# EAGLE schematic A20-OLinuXino-Lime2_Rev_C (EAGLE 6.6.0)
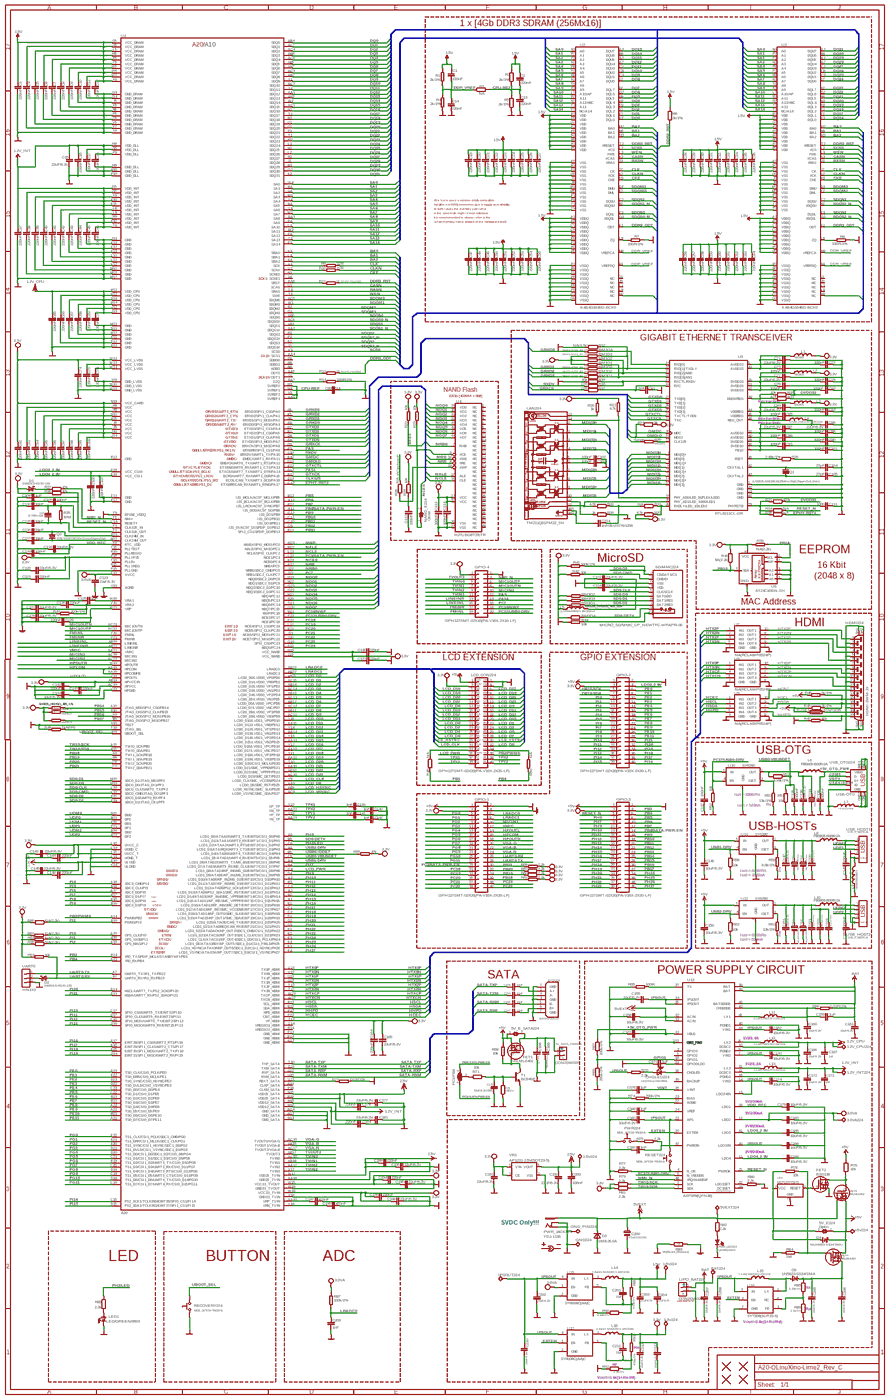
[diagram p0: schematic, sheet 1, overview]
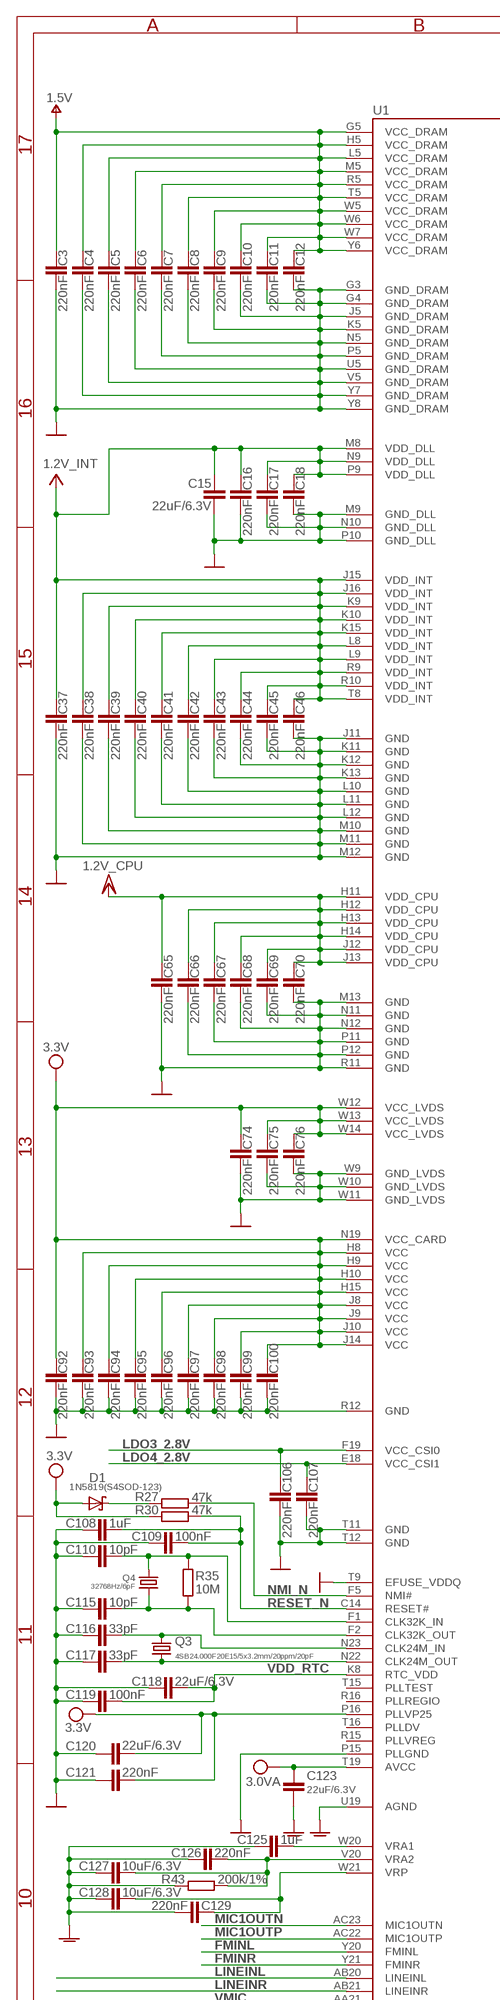
[diagram p1: schematic, sheet 1, part 1 of 4]
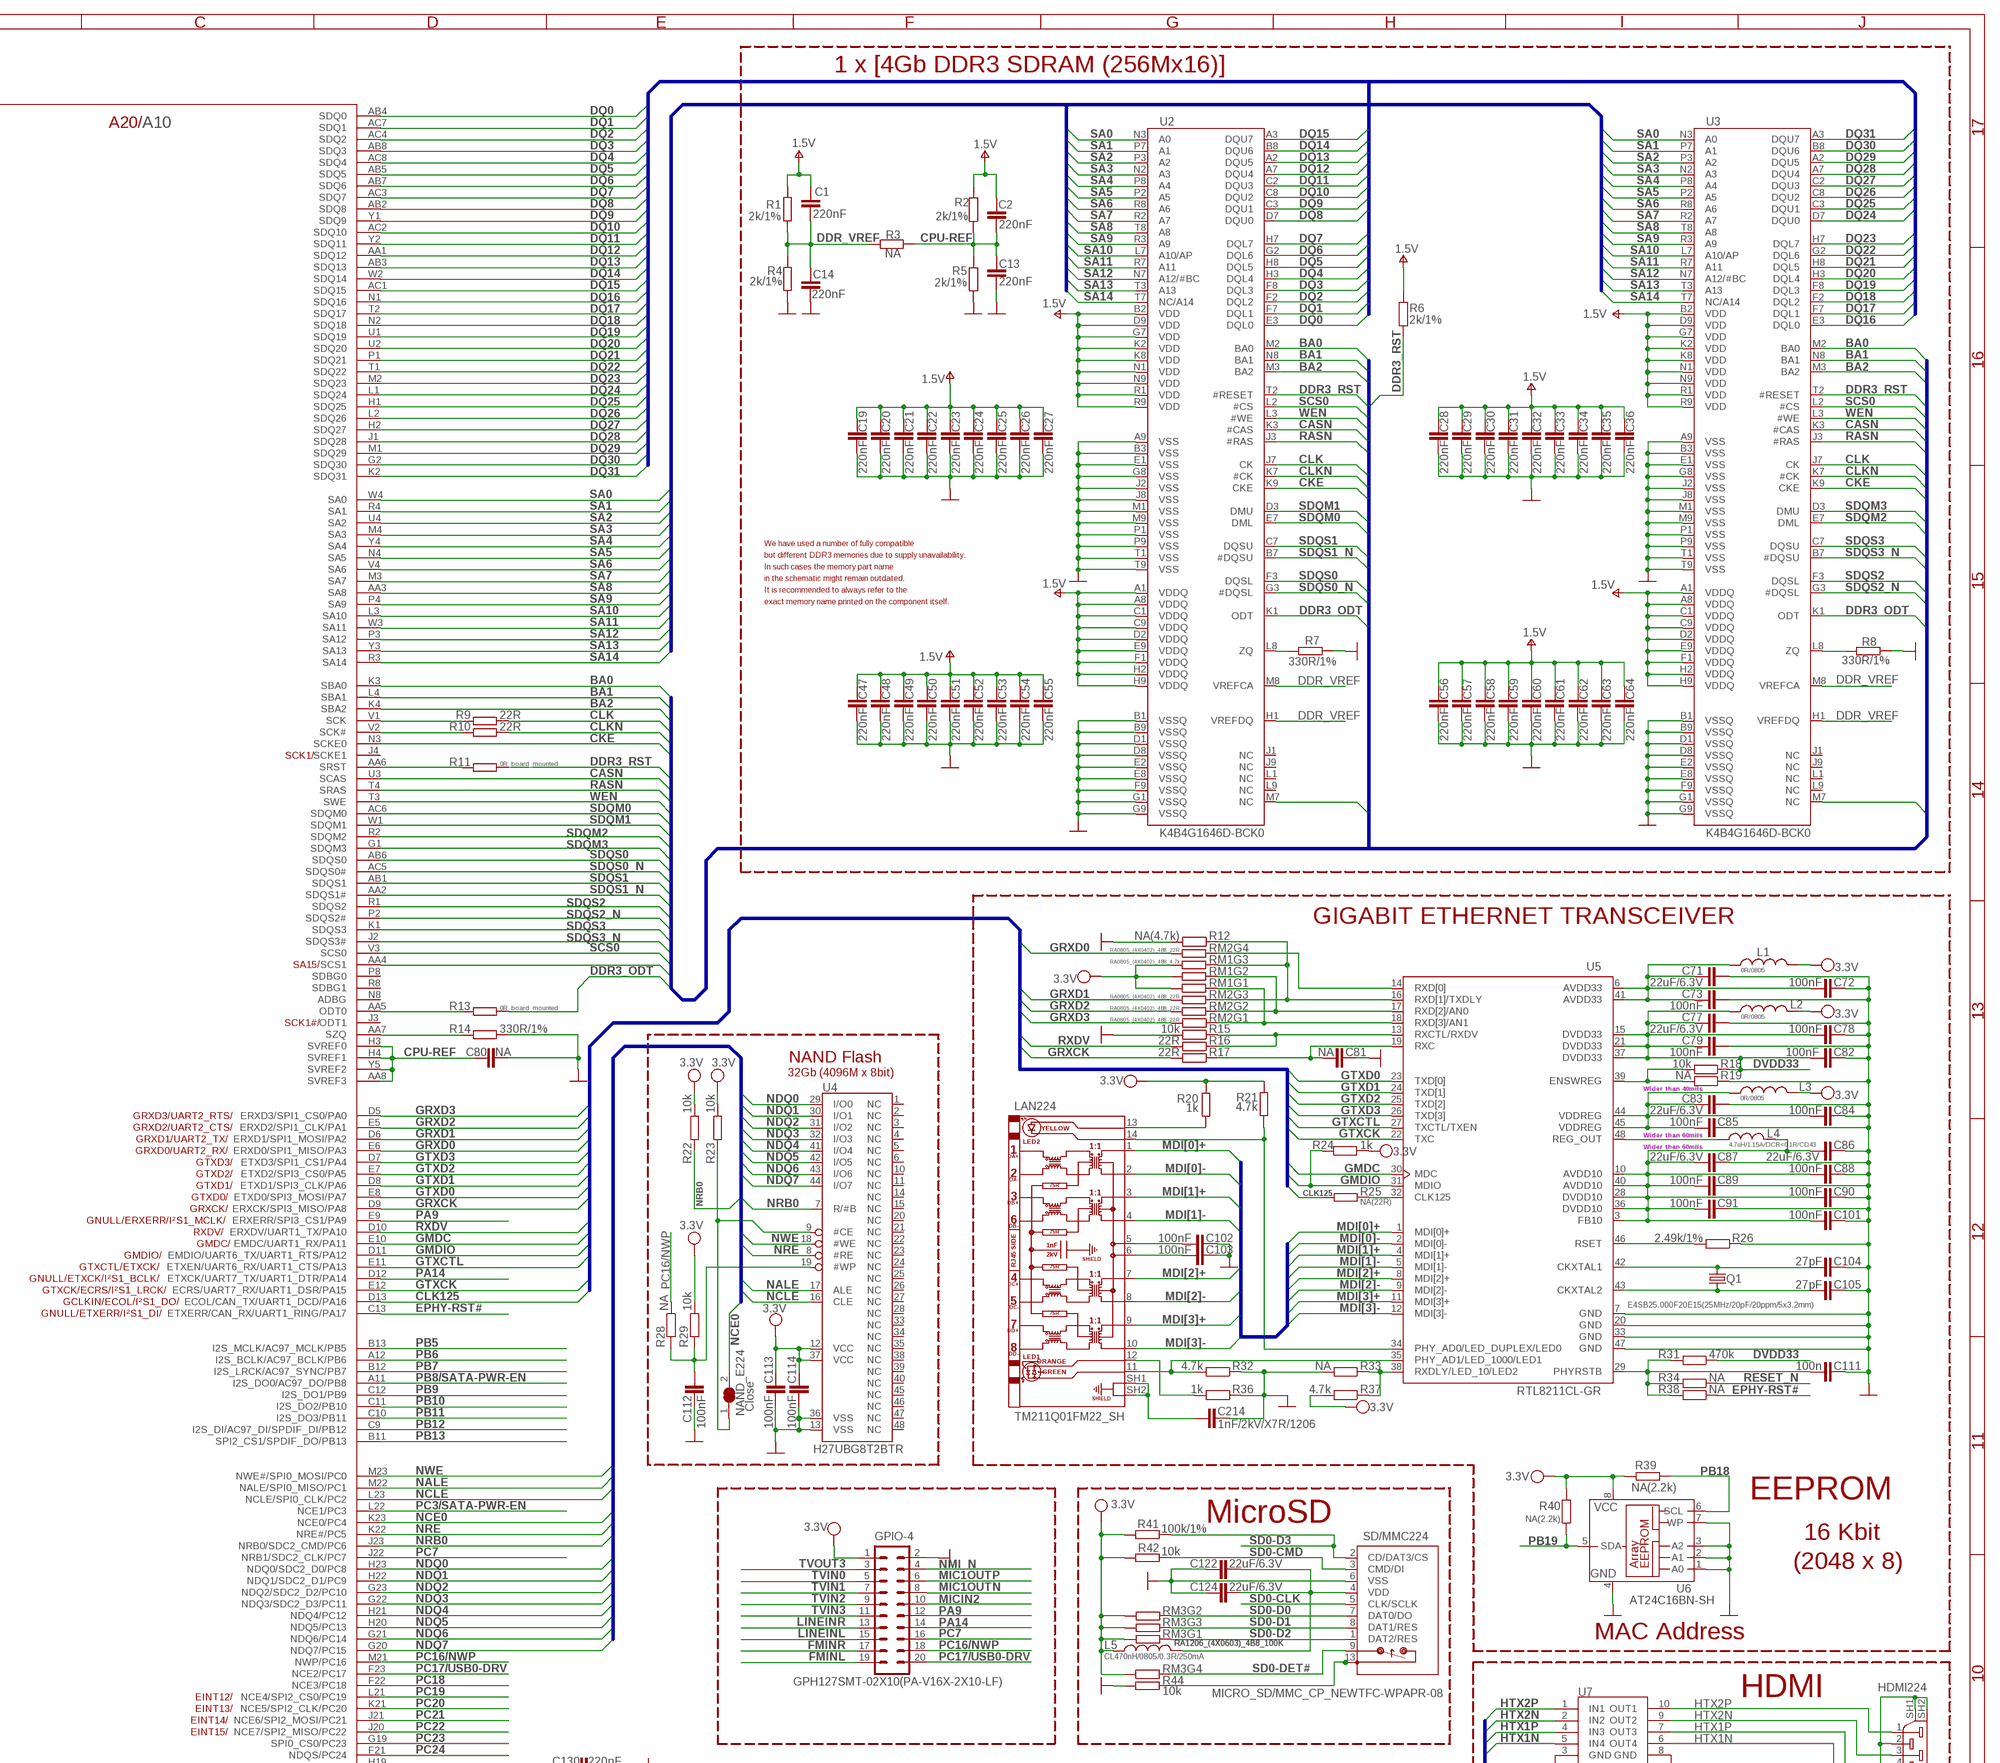
[diagram p2: schematic, sheet 1, part 2 of 4]
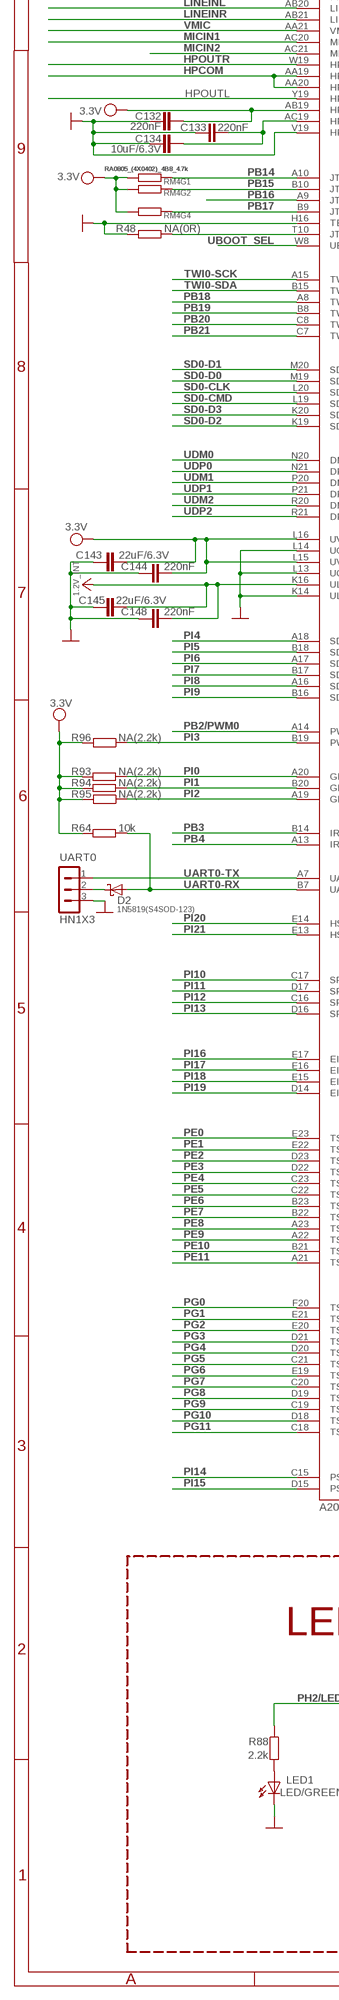
[diagram p3: schematic, sheet 1, part 3 of 4]
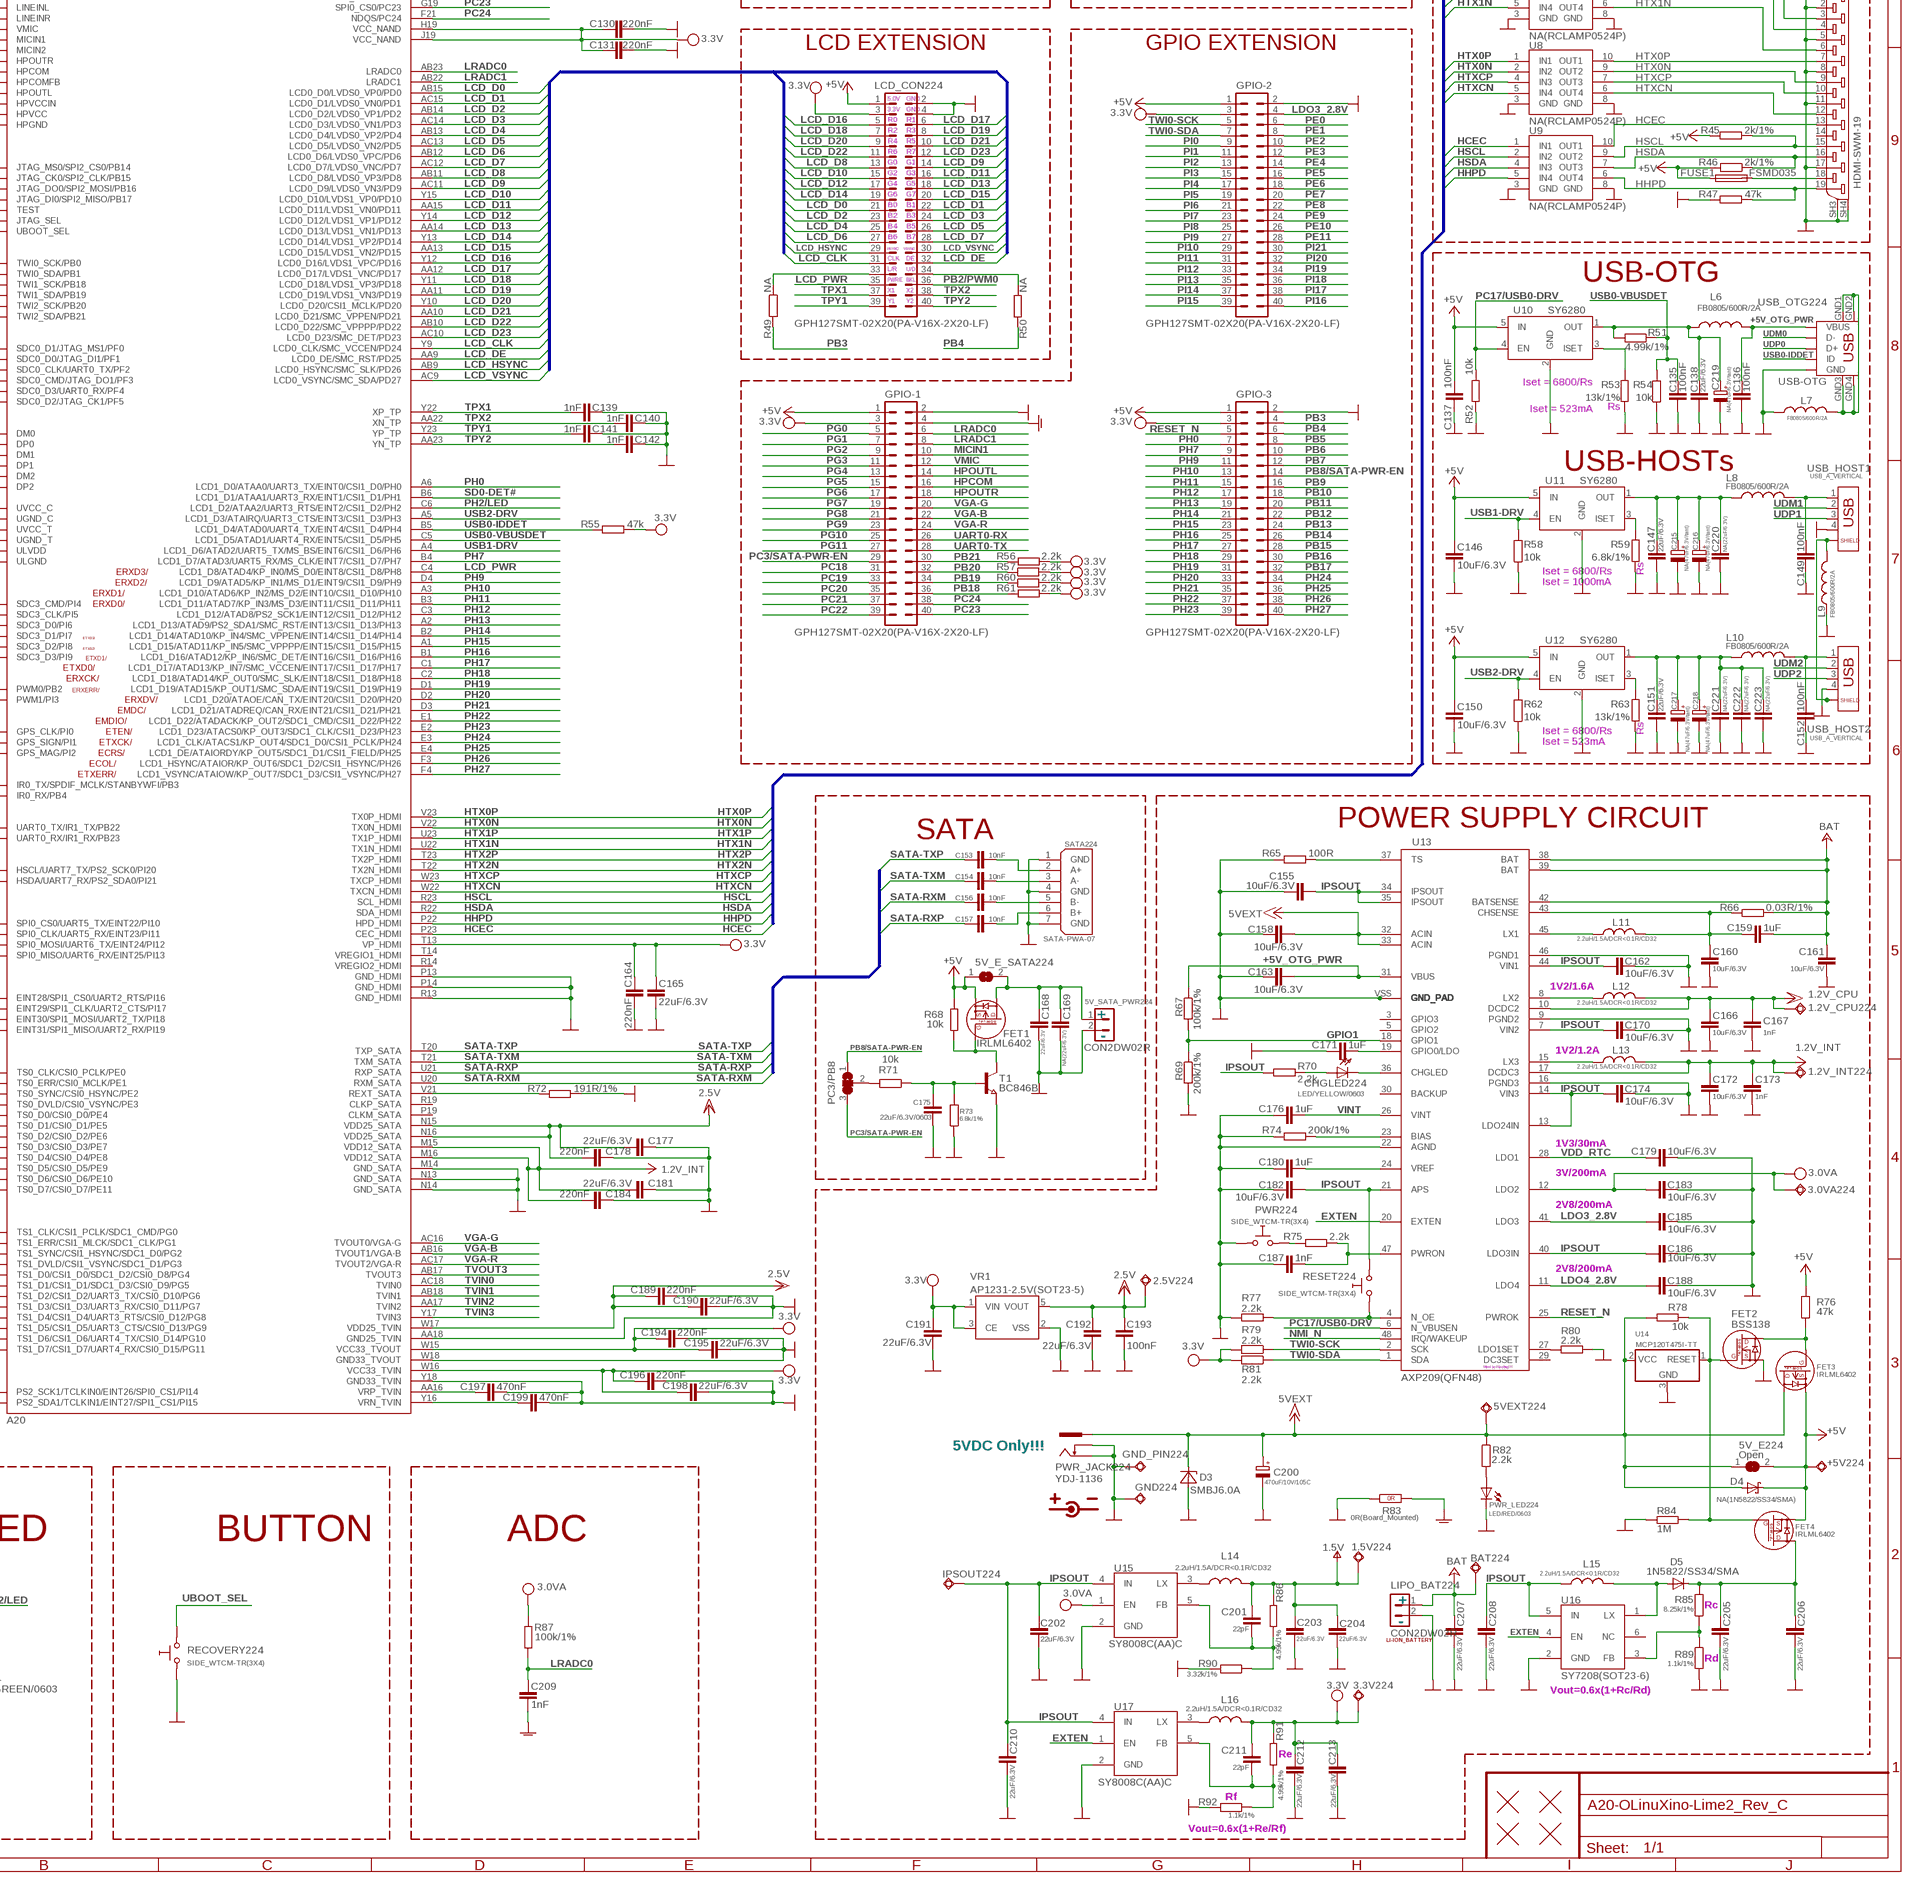
[diagram p4: schematic, sheet 1, part 4 of 4]

## Parts
1.2V_CPU224  TESTPADTESTPAD_40-ROUND  [TESTPAD_40-ROUND]
1.2V_INT224  TESTPADTESTPAD_40-ROUND  [TESTPAD_40-ROUND]
1.5V224  TESTPADTESTPAD_40-ROUND  [TESTPAD_40-ROUND]
2.5V224  TESTPADTESTPAD_40-ROUND  [TESTPAD_40-ROUND]
3.0VA224  TESTPADTESTPAD_40-ROUND  [TESTPAD_40-ROUND]
3.3V224  TESTPADTESTPAD_40-ROUND  [TESTPAD_40-ROUND]
5V_E224  Open  SJSJ_SMALLER  [SJ_1_SMALLER]
5V_E_SATA224  SJSJ_SMALLER  [SJ_1_SMALLER]
5V_SATA_PWR224  CON2DW02R  [DW02R]
5VEXT224  TESTPADTESTPAD_40-ROUND  [TESTPAD_40-ROUND]
+5V224  TESTPADTESTPAD_40-ROUND  [TESTPAD_40-ROUND]
BAT224  TESTPADTESTPAD_40-ROUND  [TESTPAD_40-ROUND]
C1  220nF  C-EUC0402_TI  [C0402_TI]
C2  220nF  C-EUC0402_TI  [C0402_TI]
C3  220nF  C-EUC0402_TI  [C0402_TI]
C4  220nF  C-EUC0402_TI  [C0402_TI]
C5  220nF  C-EUC0402_TI  [C0402_TI]
C6  220nF  C-EUC0402_TI  [C0402_TI]
C7  220nF  C-EUC0402_TI  [C0402_TI]
C8  220nF  C-EUC0402_TI  [C0402_TI]
C9  220nF  C-EUC0402_TI  [C0402_TI]
C10  220nF  C-EUC0402_TI  [C0402_TI]
C11  220nF  C-EUC0402_TI  [C0402_TI]
C12  220nF  C-EUC0402_TI  [C0402_TI]
C13  220nF  C-EUC0402_TI  [C0402_TI]
C14  220nF  C-EUC0402_TI  [C0402_TI]
C15  22uF/6.3V  C-EUC0603_DWS  [C0603_DWS]
C16  220nF  C-EUC0402_TI  [C0402_TI]
C17  220nF  C-EUC0402_TI  [C0402_TI]
C18  220nF  C-EUC0402_TI  [C0402_TI]
C19  220nF  C-EUC0402_TI  [C0402_TI]
C20  220nF  C-EUC0402_TI  [C0402_TI]
C21  220nF  C-EUC0402_TI  [C0402_TI]
C22  220nF  C-EUC0402_TI  [C0402_TI]
C23  220nF  C-EUC0402_TI  [C0402_TI]
C24  220nF  C-EUC0402_TI  [C0402_TI]
C25  220nF  C-EUC0402_TI  [C0402_TI]
C26  220nF  C-EUC0402_TI  [C0402_TI]
C27  220nF  C-EUC0402_TI  [C0402_TI]
C28  220nF  C-EUC0402_TI  [C0402_TI]
C29  220nF  C-EUC0402_TI  [C0402_TI]
C30  220nF  C-EUC0402_TI  [C0402_TI]
C31  220nF  C-EUC0402_TI  [C0402_TI]
C32  220nF  C-EUC0402_TI  [C0402_TI]
C33  220nF  C-EUC0402_TI  [C0402_TI]
C34  220nF  C-EUC0402_TI  [C0402_TI]
C35  220nF  C-EUC0402_TI  [C0402_TI]
C36  220nF  C-EUC0402_TI  [C0402_TI]
C37  220nF  C-EUC0402_TI  [C0402_TI]
C38  220nF  C-EUC0402_TI  [C0402_TI]
C39  220nF  C-EUC0402_TI  [C0402_TI]
C40  220nF  C-EUC0402_TI  [C0402_TI]
C41  220nF  C-EUC0402_TI  [C0402_TI]
C42  220nF  C-EUC0402_TI  [C0402_TI]
C43  220nF  C-EUC0402_TI  [C0402_TI]
C44  220nF  C-EUC0402_TI  [C0402_TI]
C45  220nF  C-EUC0402_TI  [C0402_TI]
C46  220nF  C-EUC0402_TI  [C0402_TI]
C47  220nF  C-EUC0402_TI  [C0402_TI]
C48  220nF  C-EUC0402_TI  [C0402_TI]
C49  220nF  C-EUC0402_TI  [C0402_TI]
C50  220nF  C-EUC0402_TI  [C0402_TI]
C51  220nF  C-EUC0402_TI  [C0402_TI]
C52  220nF  C-EUC0402_TI  [C0402_TI]
C53  220nF  C-EUC0402_TI  [C0402_TI]
C54  220nF  C-EUC0402_TI  [C0402_TI]
C55  220nF  C-EUC0402_TI  [C0402_TI]
C56  220nF  C-EUC0402_TI  [C0402_TI]
C57  220nF  C-EUC0402_TI  [C0402_TI]
C58  220nF  C-EUC0402_TI  [C0402_TI]
C59  220nF  C-EUC0402_TI  [C0402_TI]
C60  220nF  C-EUC0402_TI  [C0402_TI]
C61  220nF  C-EUC0402_TI  [C0402_TI]
C62  220nF  C-EUC0402_TI  [C0402_TI]
C63  220nF  C-EUC0402_TI  [C0402_TI]
C64  220nF  C-EUC0402_TI  [C0402_TI]
C65  220nF  C-EUC0402_TI  [C0402_TI]
C66  220nF  C-EUC0402_TI  [C0402_TI]
C67  220nF  C-EUC0402_TI  [C0402_TI]
C68  220nF  C-EUC0402_TI  [C0402_TI]
C69  220nF  C-EUC0402_TI  [C0402_TI]
C70  220nF  C-EUC0402_TI  [C0402_TI]
C71  22uF/6.3V  C-EUC0603_DWS  [C0603_DWS]
C72  100nF  C-EUC0402_TI  [C0402_TI]
C73  100nF  C-EUC0402_TI  [C0402_TI]
C74  220nF  C-EUC0402_TI  [C0402_TI]
C75  220nF  C-EUC0402_TI  [C0402_TI]
C76  220nF  C-EUC0402_TI  [C0402_TI]
C77  22uF/6.3V  C-EUC0603_DWS  [C0603_DWS]
C78  100nF  C-EUC0402_TI  [C0402_TI]
C79  100nF  C-EUC0402_TI  [C0402_TI]
C80  NA  C-EUC0402_TI  [C0402_TI]
C81  NA  C-EUC0402_TI  [C0402_TI]
C82  100nF  C-EUC0402_TI  [C0402_TI]
C83  22uF/6.3V  C-EUC0603_DWS  [C0603_DWS]
C84  100nF  C-EUC0402_TI  [C0402_TI]
C85  100nF  C-EUC0402_TI  [C0402_TI]
C86  22uF/6.3V  C-EUC0603_DWS  [C0603_DWS]
C87  22uF/6.3V  C-EUC0603_DWS  [C0603_DWS]
C88  100nF  C-EUC0402_TI  [C0402_TI]
C89  100nF  C-EUC0402_TI  [C0402_TI]
C90  100nF  C-EUC0402_TI  [C0402_TI]
C91  100nF  C-EUC0402_TI  [C0402_TI]
C92  220nF  C-EUC0402_TI  [C0402_TI]
C93  220nF  C-EUC0402_TI  [C0402_TI]
C94  220nF  C-EUC0402_TI  [C0402_TI]
C95  220nF  C-EUC0402_TI  [C0402_TI]
C96  220nF  C-EUC0402_TI  [C0402_TI]
C97  220nF  C-EUC0402_TI  [C0402_TI]
C98  220nF  C-EUC0402_TI  [C0402_TI]
C99  220nF  C-EUC0402_TI  [C0402_TI]
C100  220nF  C-EUC0402_TI  [C0402_TI]
C101  100nF  C-EUC0402_TI  [C0402_TI]
C102  100nF  C-EUC0402_TI  [C0402_TI]
C103  100nF  C-EUC0402_TI  [C0402_TI]
C104  27pF  C-EUC0603_DWS  [C0603_DWS]
C105  27pF  C-EUC0603_DWS  [C0603_DWS]
C106  220nF  C-EUC0402_TI  [C0402_TI]
C107  220nF  C-EUC0402_TI  [C0402_TI]
C108  1uF  C-EUC0603_DWS  [C0603_DWS]
C109  100nF  C-EUC0402_TI  [C0402_TI]
C110  10pF  C-EUC0402_TI  [C0402_TI]
C111  100n  C-EUC0402_TI  [C0402_TI]
C112  100nF  C-EUC0402_TI  [C0402_TI]
C113  100nF  C-EUC0402_TI  [C0402_TI]
C114  100nF  C-EUC0402_TI  [C0402_TI]
C115  10pF  C-EUC0402_TI  [C0402_TI]
C116  33pF  C-EUC0603_DWS  [C0603_DWS]
C117  33pF  C-EUC0603_DWS  [C0603_DWS]
C118  22uF/6.3V  C-EUC0603_DWS  [C0603_DWS]
C119  100nF  C-EUC0402_TI  [C0402_TI]
C120  22uF/6.3V  C-EUC0603_DWS  [C0603_DWS]
C121  220nF  C-EUC0402_TI  [C0402_TI]
C122  22uF/6.3V  C-EUC0603_DWS  [C0603_DWS]
C123  22uF/6.3V  C-EUC0603_DWS  [C0603_DWS]
C124  22uF/6.3V  C-EUC0603_DWS  [C0603_DWS]
C125  1uF  C-EUC0603_DWS  [C0603_DWS]
C126  220nF  C-EUC0402_TI  [C0402_TI]
C127  10uF/6.3V  C-EUC0603_DWS  [C0603_DWS]
C128  10uF/6.3V  C-EUC0603_DWS  [C0603_DWS]
C129  220nF  C-EUC0402_TI  [C0402_TI]
C130  220nF  C-EUC0402_TI  [C0402_TI]
C131  220nF  C-EUC0402_TI  [C0402_TI]
C132  220nF  C-EUC0402_TI  [C0402_TI]
C133  220nF  C-EUC0402_TI  [C0402_TI]
C134  10uF/6.3V  C-EUC0603_DWS  [C0603_DWS]
C135  100nF  C-EUC0402_TI  [C0402_TI]
C136  100nF  C-EUC0402_TI  [C0402_TI]
C137  100nF  C-EUC0402_TI  [C0402_TI]
C138  22uF/6.3V  C-EUC0603_DWS  [C0603_DWS]
C139  1nF  C-EUC0402_TI  [C0402_TI]
C140  1nF  C-EUC0402_TI  [C0402_TI]
C141  1nF  C-EUC0402_TI  [C0402_TI]
C142  1nF  C-EUC0402_TI  [C0402_TI]
C143  22uF/6.3V  C-EUC0603_DWS  [C0603_DWS]
C144  220nF  C-EUC0402_TI  [C0402_TI]
C145  22uF/6.3V  C-EUC0603_DWS  [C0603_DWS]
C146  10uF/6.3V  C-EUC0603_DWS  [C0603_DWS]
C147  22uF/6.3V  C-EUC0603_DWS  [C0603_DWS]
C148  220nF  C-EUC0402_TI  [C0402_TI]
C149  100nF  C-EUC0402_TI  [C0402_TI]
C150  10uF/6.3V  C-EUC0603_DWS  [C0603_DWS]
C151  22uF/6.3V  C-EUC0603_DWS  [C0603_DWS]
C152  100nF  C-EUC0402_TI  [C0402_TI]
C153  10nF  C-EUC0402_TI  [C0402_TI]
C154  10nF  C-EUC0402_TI  [C0402_TI]
C155  10uF/6.3V  C-EUC0603_DWS  [C0603_DWS]
C156  10nF  C-EUC0402_TI  [C0402_TI]
C157  10nF  C-EUC0402_TI  [C0402_TI]
C158  10uF/6.3V  C-EUC0603_DWS  [C0603_DWS]
C159  1uF  C-EUC0603_DWS  [C0603_DWS]
C160  10uF/6.3V  C-EUC0603_DWS  [C0603_DWS]
C161  10uF/6.3V  C-EUC0603_DWS  [C0603_DWS]
C162  10uF/6.3V  C-EUC0603_DWS  [C0603_DWS]
C163  10uF/6.3V  C-EUC0603_DWS  [C0603_DWS]
C164  220nF  C-EUC0402_TI  [C0402_TI]
C165  22uF/6.3V  C-EUC0603_DWS  [C0603_DWS]
C166  10uF/6.3V  C-EUC0603_DWS  [C0603_DWS]
C167  1nF  C-EUC0402_TI  [C0402_TI]
C168  22uF/6.3V  C-EUC0603_DWS  [C0603_DWS]
C169  NA(22uF/6.3V)  C-EUC0603_DWS  [C0603_DWS]
C170  10uF/6.3V  C-EUC0603_DWS  [C0603_DWS]
C171  1uF  C-EUC0603_DWS  [C0603_DWS]
C172  10uF/6.3V  C-EUC0603_DWS  [C0603_DWS]
C173  1nF  C-EUC0402_TI  [C0402_TI]
C174  10uF/6.3V  C-EUC0603_DWS  [C0603_DWS]
C175  22uF/6.3V/0603  C-EUC0603_DWS  [C0603_DWS]
C176  1uF  C-EUC0603_DWS  [C0603_DWS]
C177  22uF/6.3V  C-EUC0603_DWS  [C0603_DWS]
C178  220nF  C-EUC0402_TI  [C0402_TI]
C179  10uF/6.3V  C-EUC0603_DWS  [C0603_DWS]
C180  1uF  C-EUC0603_DWS  [C0603_DWS]
C181  22uF/6.3V  C-EUC0603_DWS  [C0603_DWS]
C182  10uF/6.3V  C-EUC0603_DWS  [C0603_DWS]
C183  10uF/6.3V  C-EUC0603_DWS  [C0603_DWS]
C184  220nF  C-EUC0402_TI  [C0402_TI]
C185  10uF/6.3V  C-EUC0603_DWS  [C0603_DWS]
C186  10uF/6.3V  C-EUC0603_DWS  [C0603_DWS]
C187  1nF  C-EUC0402_TI  [C0402_TI]
C188  10uF/6.3V  C-EUC0603_DWS  [C0603_DWS]
C189  220nF  C-EUC0402_TI  [C0402_TI]
C190  22uF/6.3V  C-EUC0603_DWS  [C0603_DWS]
C191  22uF/6.3V  C-EUC0603_DWS  [C0603_DWS]
C192  22uF/6.3V  C-EUC0603_DWS  [C0603_DWS]
C193  100nF  C-EUC0402_TI  [C0402_TI]
C194  220nF  C-EUC0402_TI  [C0402_TI]
C195  22uF/6.3V  C-EUC0603_DWS  [C0603_DWS]
C196  220nF  C-EUC0402_TI  [C0402_TI]
C197  470nF  C-EUC0603_DWS  [C0603_DWS]
C198  22uF/6.3V  C-EUC0603_DWS  [C0603_DWS]
C199  470nF  C-EUC0603_DWS  [C0603_DWS]
C200  470uF/10V/105C  CPOL-EUE2.5-6.3  [E2,5-6,3]
C201  22pF  C-EUC0603_DWS  [C0603_DWS]
C202  22uF/6.3V  C-EUC0603_DWS  [C0603_DWS]
C203  22uF/6.3V  C-EUC0603_DWS  [C0603_DWS]
C204  22uF/6.3V  C-EUC0603_DWS  [C0603_DWS]
C205  22uF/6.3V  C-EUC0603_DWS  [C0603_DWS]
C206  22uF/6.3V  C-EUC0603_DWS  [C0603_DWS]
C207  22uF/6.3V  C-EUC0603_DWS  [C0603_DWS]
C208  22uF/6.3V  C-EUC0603_DWS  [C0603_DWS]
C209  1nF  C-EUC0402_TI  [C0402_TI]
C210  22uF/6.3V  C-EUC0603_DWS  [C0603_DWS]
C211  22pF  C-EUC0603_DWS  [C0603_DWS]
C212  22uF/6.3V  C-EUC0603_DWS  [C0603_DWS]
C213  22uF/6.3V  C-EUC0603_DWS  [C0603_DWS]
C214  1nF/2kV/X7R/1206  C-EUC1206_5MILS_WS_ISO  [C1206_5MILS_WS_ISO]
C215  NA(47uF/6.3V/tant)  CPOL-EUCT3528_MIL  [CT3528_MIL]
C216  NA(47uF/6.3V/tant)  CPOL-EUCT3528_MIL  [CT3528_MIL]
C217  NA(47uF/6.3V/tant)  CPOL-EUCT3528_MIL  [CT3528_MIL]
C218  NA(47uF/6.3V/tant)  CPOL-EUCT3528_MIL  [CT3528_MIL]
C219  NA(47uF/6.3V/tant)  CPOL-EUCT3528_MIL  [CT3528_MIL]
C220  NA(22uF/6.3V)  C-EUC0603_DWS  [C0603_DWS]
C221  NA(22uF/6.3V)  C-EUC0603_DWS  [C0603_DWS]
C222  NA(22uF/6.3V)  C-EUC0603_DWS  [C0603_DWS]
C223  NA(22uF/6.3V)  C-EUC0603_DWS  [C0603_DWS]
CHGLED224  LED/YELLOW/0603  LED0603DWS  [LED-0603]
D1  1N5819(S4SOD-123)  SCHOTKKY7.62SS-1N5819(S4SOD-123)  [SOD-123]
D2  1N5819(S4SOD-123)  SCHOTKKY7.62SS-1N5819(S4SOD-123)  [SOD-123]
D3  SMBJ6.0A  SMBJ16A  [DO214AA]
D4  NA(1N5822/SS34/SMA)  SCHOTKKY7.62SS2  [MLL-41]
D5  1N5822/SS34/SMA  D-MLL-41  [MELF-MLL41]
FET1  IRLML6402  P-MOS+DIODIRLML6402  [SOT23]
FET2  BSS138  N-MOS+DIODBSS138(SOT23-3)  [SOT23]
FET3  IRLML6402  P-MOS+DIODIRLML6402  [SOT23]
FET4  IRLML6402  P-MOS+DIODIRLML6402  [SOT23]
FUSE1  FSMD035  FUSE  [1206]
GND224  TESTPADTESTPAD_40-ROUND  [TESTPAD_40-ROUND]
GND_PIN224  TESTPAD3  [TEST_PAD40/70/SQUARE]
GPIO-1  GPH127SMT-02X20(PA-V16X-2X20-LF)  ML40-GPH127SMT-02X20(PA-V16X-2X20-LF)  [GPH127SMT-02X20(PA-V16X-2X20-LF)]
GPIO-2  GPH127SMT-02X20(PA-V16X-2X20-LF)  ML40-GPH127SMT-02X20(PA-V16X-2X20-LF)  [GPH127SMT-02X20(PA-V16X-2X20-LF)]
GPIO-3  GPH127SMT-02X20(PA-V16X-2X20-LF)  ML40-GPH127SMT-02X20(PA-V16X-2X20-LF)  [GPH127SMT-02X20(PA-V16X-2X20-LF)]
GPIO-4  GPH127SMT-02X10(PA-V16X-2X10-LF)  ML20GPH127SMT-02X10(PA-V16X-2X10-LF)  [GPH127SMT-02X10(PA-V16X-2X10-LF)]
HDMI224  HDMI-SWM-19  HDMI-MC34931HDMI-SWM-19  [HDMI-SWM-19]
IPSOUT224  TESTPADTESTPAD_40-ROUND  [TESTPAD_40-ROUND]
L1  0R/0805  L-USL0805_5MIL_DWS  [L0805_5MIL_DWS]
L2  0R/0805  L-USL0805_5MIL_DWS  [L0805_5MIL_DWS]
L3  0R/0805  L-USL0805_5MIL_DWS  [L0805_5MIL_DWS]
L4  4.7uH/1.15A/DCR<0.1R/CD43  L-CD42(43)  [CD42(43)]
L5  CL470nH/0805/0.3R/250mA  L-USL0805_5MIL_DWS  [L0805_5MIL_DWS]
L6  FB0805/600R/2A  L-USL0805_5MIL_DWS  [L0805_5MIL_DWS]
L7  FB0805/600R/2A  L-USL0805_5MIL_DWS  [L0805_5MIL_DWS]
L8  FB0805/600R/2A  L-USL0805_5MIL_DWS  [L0805_5MIL_DWS]
L9  FB0805/600R/2A  L-USL0805_5MIL_DWS  [L0805_5MIL_DWS]
L10  FB0805/600R/2A  L-USL0805_5MIL_DWS  [L0805_5MIL_DWS]
L11  2.2uH/1.5A/DCR<0.1R/CD32  L-CD32  [CD32]
L12  2.2uH/1.5A/DCR<0.1R/CD32  L-CD32  [CD32]
L13  2.2uH/1.5A/DCR<0.1R/CD32  L-CD32  [CD32]
L14  2.2uH/1.5A/DCR<0.1R/CD32  L-CD32  [CD32]
L15  2.2uH/1.5A/DCR<0.1R/CD32  L-CD32  [CD32]
L16  2.2uH/1.5A/DCR<0.1R/CD32  L-CD32  [CD32]
LAN224  TM211Q01FM22_SH  [TM211Q01FM22_SH]
LCD_CON224  GPH127SMT-02X20(PA-V16X-2X20-LF)  ML40-GPH127SMT-02X20(PA-V16X-2X20-LF)  [GPH127SMT-02X20(PA-V16X-2X20-LF)]
LED1  LED/GREEN/0603  LED0603DWS  [LED-0603]
LIPO_BAT224  CON2DW02R  [DW02R]
NAND_E224  Close  SJSJ_1_SMALLER_CLOSE_10MILS  [SJ_1_SMALLER_CLOSE_10MILS]
PC3/PB8  SJ2W5  [SJ_2_SMALL_23_TIED]
PWR224  SIDE_WTCM-TR(3X4)  SW-TAKTSIDE_WTCM-TR(3X4)  [SW_TAKT3X4]
PWR_JACK224  YDJ-1136  PWR-JAKPWR_JACK_UNI_MILLING  [PWR_JACK_UNI_MILLING]
PWR_LED224  LED/RED/0603  LED0603DWS  [LED-0603]
Q1  E4SB25.000F20E15(25MHz/20pF/20ppm/5x3.2mm)  HC49/S_E4SB25.000F20E15  [HCX-4S]
Q3  4SB24.000F20E15/5x3.2mm/20ppm/20pF  HC49/S_E4SB25.000F20E15  [HCX-4S]
Q4  32768Hz/6pF  MC-306_32.768KHZ/SMD_8038  [MC-306]
R1  2k/1%  R-EU_R0402_TI  [R0402_TI]
R2  2k/1%  R-EU_R0402_TI  [R0402_TI]
R3  NA  R-EU_R0402_TI  [R0402_TI]
R4  2k/1%  R-EU_R0402_TI  [R0402_TI]
R5  2k/1%  R-EU_R0402_TI  [R0402_TI]
R6  2k/1%  R-EU_R0402_TI  [R0402_TI]
R7  330R/1%  R-EU_R0603_5MIL_DWS  [R0603_5MIL_DWS]
R8  330R/1%  R-EU_R0603_5MIL_DWS  [R0603_5MIL_DWS]
R9  22R  R-EU_R0402_TI  [R0402_TI]
R10  22R  R-EU_R0402_TI  [R0402_TI]
R11  0R_board_mounted  R-EU_R0402_TI_0R  [R0402_TI_0R]
R12  NA(4.7k)  R-EU_R0402_TI  [R0402_TI]
R13  0R_board_mounted  R-EU_R0402_TI_0R  [R0402_TI_0R]
R14  330R/1%  R-EU_R0603_5MIL_DWS  [R0603_5MIL_DWS]
R15  10k  R-EU_R0402_TI  [R0402_TI]
R16  22R  R-EU_R0402_TI  [R0402_TI]
R17  22R  R-EU_R0402_TI  [R0402_TI]
R18  10k  R-EU_R0402_TI  [R0402_TI]
R19  NA  R-EU_R0402_TI  [R0402_TI]
R20  1k  R-EU_R0402_TI  [R0402_TI]
R21  4.7k  R-EU_R0402_TI  [R0402_TI]
R22  10k  R-EU_R0402_TI  [R0402_TI]
R23  10k  R-EU_R0402_TI  [R0402_TI]
R24  1k  R-EU_R0402_TI  [R0402_TI]
R25  NA(22R)  R-EU_R0402_TI  [R0402_TI]
R26  2.49k/1%  R-EU_R0603_5MIL_DWS  [R0603_5MIL_DWS]
R27  47k  R-EU_R0402_TI  [R0402_TI]
R28  NA  R-EU_R0402_TI  [R0402_TI]
R29  10k  R-EU_R0402_TI  [R0402_TI]
R30  47k  R-EU_R0402_TI  [R0402_TI]
R31  470k  R-EU_R0402_TI  [R0402_TI]
R32  4.7k  R-EU_R0402_TI  [R0402_TI]
R33  NA  R-EU_R0402_TI  [R0402_TI]
R34  NA  R-EU_R0402_TI  [R0402_TI]
R35  10M  R-EU_R0402_TI  [R0402_TI]
R36  1k  R-EU_R0402_TI  [R0402_TI]
R37  4.7k  R-EU_R0402_TI  [R0402_TI]
R38  NA  R-EU_R0402_TI  [R0402_TI]
R39  NA(2.2k)  R-EU_R0402_TI  [R0402_TI]
R40  NA(2.2k)  R-EU_R0402_TI  [R0402_TI]
R41  100k/1%  R-EU_R0603_5MIL_DWS  [R0603_5MIL_DWS]
R42  10k  R-EU_R0402_TI  [R0402_TI]
R43  200k/1%  R-EU_R0603_5MIL_DWS  [R0603_5MIL_DWS]
R44  10k  R-EU_R0402_TI  [R0402_TI]
R45  2k/1%  R-EU_R0402_TI  [R0402_TI]
R46  2k/1%  R-EU_R0402_TI  [R0402_TI]
R47  47k  R-EU_R0402_TI  [R0402_TI]
R48  NA(0R)  R-EU_R0603_5MIL_DWS  [R0603_5MIL_DWS]
R49  NA  R-EU_R0603_5MIL_DWS  [R0603_5MIL_DWS]
R50  NA  R-EU_R0603_5MIL_DWS  [R0603_5MIL_DWS]
R51  4.99k/1%  R-EU_R0603_5MIL_DWS  [R0603_5MIL_DWS]
R52  10k  R-EU_R0402_TI  [R0402_TI]
R53  13k/1%  R-EU_R0603_5MIL_DWS  [R0603_5MIL_DWS]
R54  10k  R-EU_R0402_TI  [R0402_TI]
R55  47k  R-EU_R0402_TI  [R0402_TI]
R56  2.2k  R-EU_R0402_TI  [R0402_TI]
R57  2.2k  R-EU_R0402_TI  [R0402_TI]
R58  10k  R-EU_R0402_TI  [R0402_TI]
R59  6.8k/1%  R-EU_R0603_5MIL_DWS  [R0603_5MIL_DWS]
R60  2.2k  R-EU_R0402_TI  [R0402_TI]
R61  2.2k  R-EU_R0402_TI  [R0402_TI]
R62  10k  R-EU_R0402_TI  [R0402_TI]
R63  13k/1%  R-EU_R0603_5MIL_DWS  [R0603_5MIL_DWS]
R64  10k  R-EU_R0402_TI  [R0402_TI]
R65  100R  R-EU_R0603_5MIL_DWS  [R0603_5MIL_DWS]
R66  0.03R/1%  R-EU_R1206_5MIL_WS  [R1206_5MIL_WS]
R67  100k/1%  R-EU_R0603_5MIL_DWS  [R0603_5MIL_DWS]
R68  10k  R-EU_R0402_TI  [R0402_TI]
R69  200k/1%  R-EU_R0603_5MIL_DWS  [R0603_5MIL_DWS]
R70  2.2k  R-EU_R0402_TI  [R0402_TI]
R71  10k  R-EU_R0402_TI  [R0402_TI]
R72  191R/1%  R-EU_R0603_5MIL_DWS  [R0603_5MIL_DWS]
R73  6.8k/1%  R-EU_R0603_5MIL_DWS  [R0603_5MIL_DWS]
R74  200k/1%  R-EU_R0603_5MIL_DWS  [R0603_5MIL_DWS]
R75  2.2k  R-EU_R0402_TI  [R0402_TI]
R76  47k  R-EU_R0402_TI  [R0402_TI]
R77  2.2k  R-EU_R0402_TI  [R0402_TI]
R78  10k  R-EU_R0402_TI  [R0402_TI]
R79  2.2k  R-EU_R0402_TI  [R0402_TI]
R80  2.2k  R-EU_R0402_TI  [R0402_TI]
R81  2.2k  R-EU_R0402_TI  [R0402_TI]
R82  2.2k  R-EU_R0402_TI  [R0402_TI]
R83  0R(Board_Mounted)  R_0R0R(NA)  [0603_0R]
R84  1M  R-EU_R0402_TI  [R0402_TI]
R85  8.25k/1%  R-EU_R0603_5MIL_DWS  [R0603_5MIL_DWS]
R86  4.99k/1%  R-EU_R0603_5MIL_DWS  [R0603_5MIL_DWS]
R87  100k/1%  R-EU_R0603_5MIL_DWS  [R0603_5MIL_DWS]
R88  2.2k  R-EU_R0402_TI  [R0402_TI]
R89  1.1k/1%  R-EU_R0603_5MIL_DWS  [R0603_5MIL_DWS]
R90  3.32k/1%  R-EU_R0603_5MIL_DWS  [R0603_5MIL_DWS]
R91  4.99k/1%  R-EU_R0603_5MIL_DWS  [R0603_5MIL_DWS]
R92  1.1k/1%  R-EU_R0603_5MIL_DWS  [R0603_5MIL_DWS]
R93  NA(2.2k)  R-EU_R0402_TI  [R0402_TI]
R94  NA(2.2k)  R-EU_R0402_TI  [R0402_TI]
R95  NA(2.2k)  R-EU_R0402_TI  [R0402_TI]
R96  NA(2.2k)  R-EU_R0402_TI  [R0402_TI]
RECOVERY224  SIDE_WTCM-TR(3X4)  SW-TAKTSIDE_WTCM-TR(3X4)  [SW_TAKT3X4]
RESET224  SIDE_WTCM-TR(3X4)  SW-TAKTSIDE_WTCM-TR(3X4)  [SW_TAKT3X4]
RM1  RA0805_(4X0402)_4B8_4.7k  R_MATRIX_4E_25X625  [R_MATRIX_4_0402_25X625]
RM2  RA0805_(4X0402)_4B8_22R  R_MATRIX_4E_25X625  [R_MATRIX_4_0402_25X625]
RM3  RA1206_(4X0603)_4B8_100K  R_MATRIX_4E  [R_MATRIX_4]
RM4  RA0805_(4X0402)_4B8_4.7k  R_MATRIX_4E_25X625  [R_MATRIX_4_0402_25X625]
SATA224  SATA-PWA-07  [SATA-PWA-07]
SD/MMC224  MICRO_SD/MMC_CP_NEWTFC-WPAPR-08  [TFC-WPAPR-08]
T1  BC846B  NPN-TRANSISTOR_SOT23  [SOT23]
U1  A20  A10  [TFBGA441]
U2  K4B4G1646D-BCK0  H5TQ2G63BFR_MEM4G16D3EABG-125HYNIX  [FBGA96_SK]
U3  K4B4G1646D-BCK0  H5TQ2G63BFR_MEM4G16D3EABG-125HYNIX  [FBGA96_SK]
U4  H27UBG8T2BTR  H27UBG8T2A  [TSOP48]
U5  RTL8211CL-GR  [LQFP48]
U6  AT24C16BN-SH  24LCXX  [SO-08MN]
U7  NA(RCLAMP0524P)  RCLAMP0524P  [SLP2510P8]
U8  NA(RCLAMP0524P)  RCLAMP0524P  [SLP2510P8]
U9  NA(RCLAMP0524P)  RCLAMP0524P  [SLP2510P8]
U10  SY6280  [SOT23-5]
U11  SY6280  [SOT23-5]
U12  SY6280  [SOT23-5]
U13  AXP209(QFN48)  AXP209  [QFN48]
U14  MCP120T475I-TT  RESETMCP130T-300-I/TT  [SOT23]
U15  SY8008C(AA)C  SY8008  [SOT23-5]
U16  SY7208(SOT23-6)  SY7208  [SOT23-6]
U17  SY8008C(AA)C  SY8008  [SOT23-5]
U18  FIDUCIAL  [FIDUCIAL-1X3]
U19  FIDUCIAL  [FIDUCIAL-1X3]
U20  FIDUCIAL  [FIDUCIAL-1X3]
U21  FIDUCIAL  [FIDUCIAL-1X3]
UART0  HN1X3  CON3HN1X3  [HN1X3]
USB_HOST1  USB_A_VERTICAL  USB_SHIELDUSB_A_VERTICAL  [USB_A_VERTICAL_PTH]
USB_HOST2  USB_A_VERTICAL  USB_SHIELDUSB_A_VERTICAL  [USB_A_VERTICAL_PTH]
USB_OTG224  USB-OTG  MINI_USB9  [USB_MINI_9PIN]
VR1  AP1231-2.5V(SOT23-5)  AP1231-33  [SOT-23-5]

## Nets
5VEXT: 5V_E224.1 5VEXT224.1(PP) C158.2 C200.+ D3.C D4.A FET3.3(D) PWR_JACK224.+ R78.1 R82.1 U13.32(ACIN) U13.33(ACIN) U14.2(VCC)
+5V: 5V_E224.2 5V_E_SATA224.1 +5V224.1(PP) C137.1 C146.1 C150.1 D4.K(C) FET1.2(S) FET3.2(S) FET4.2(S) FUSE1.1 GPIO-1.1 GPIO-2.1 GPIO-3.1 LCD_CON224.1 R45.2 R46.2 R68.1 R76.2 U10.5(IN) U11.5(IN) U12.5(IN)
+5V_OTG_PWR: C136.1 C163.2 L6.1 R67.1 U13.31(VBUS) USB_OTG224.VBUS
+24V: BAT224.1(PP) C159.2 C161.1 C207.2 LIPO_BAT224.1 R66.2 U13.38(BAT) U13.39(BAT) U13.42(BATSENSE) ; supply symbol labelled BAT
AVDD1: C71.2 C72.2 C73.2 L1.2 U5.6(AVDD33) U5.41(AVDD33)
AVDD/DVDD(1.05V): C86.2 C87.2 C88.2 C89.2 C90.2 C91.2 C101.2 L4.2 U5.3(FB10) U5.10(AVDD10) U5.28(DVDD10) U5.36(DVDD10) U5.40(AVDD10)
BA0: U1.K3(SBA0) U2.M2(BA0) U3.M2(BA0)
BA1: U1.L4(SBA1) U2.N8(BA1) U3.N8(BA1)
BA2: U1.K4(SBA2) U2.M3(BA2) U3.M3(BA2)
CASN: U1.U3(SCAS) U2.K3(#CAS) U3.K3(#CAS)
CKE: U1.N3(SCKE0) U2.K9(CKE) U3.K9(CKE)
CLK: R9.1 U2.J7(CK) U3.J7(CK)
CLK125: R25.1 U1.D13(ECOL/CAN_TX/UART1_DCD/PA16)
CLKN: R10.1 U2.K7(#CK) U3.K7(#CK)
CPU-REF: C2.2 C13.2 C80.2 R2.1 R3.2 R5.2 U1.AA8(SVREF3) U1.H3(SVREF0) U1.H4(SVREF1) U1.Y5(SVREF2)
DDR3_ODT: R13.1 U2.K1(ODT) U3.K1(ODT)
DDR3_RST: R6.1 R11.1 U2.T2(#RESET) U3.T2(#RESET)
DDR_VREF: C1.2 C14.2 R1.1 R3.1 R4.2 U2.H1(VREFDQ) U2.M8(VREFCA) U3.H1(VREFDQ) U3.M8(VREFCA)
DQ0: U1.AB4(SDQ0) U2.E3(DQL0)
DQ1: U1.AC7(SDQ1) U2.F7(DQL1)
DQ2: U1.AC4(SDQ2) U2.F2(DQL2)
DQ3: U1.AB8(SDQ3) U2.F8(DQL3)
DQ4: U1.AC8(SDQ4) U2.H3(DQL4)
DQ5: U1.AB5(SDQ5) U2.H8(DQL5)
DQ6: U1.AB7(SDQ6) U2.G2(DQL6)
DQ7: U1.AC3(SDQ7) U2.H7(DQL7)
DQ8: U1.AB2(SDQ8) U2.D7(DQU0)
DQ9: U1.Y1(SDQ9) U2.C3(DQU1)
DQ10: U1.AC2(SDQ10) U2.C8(DQU2)
DQ11: U1.Y2(SDQ11) U2.C2(DQU3)
DQ12: U1.AA1(SDQ12) U2.A7(DQU4)
DQ13: U1.AB3(SDQ13) U2.A2(DQU5)
DQ14: U1.W2(SDQ14) U2.B8(DQU6)
DQ15: U1.AC1(SDQ15) U2.A3(DQU7)
DQ16: U1.N1(SDQ16) U3.E3(DQL0)
DQ17: U1.T2(SDQ17) U3.F7(DQL1)
DQ18: U1.N2(SDQ18) U3.F2(DQL2)
DQ19: U1.U1(SDQ19) U3.F8(DQL3)
DQ20: U1.U2(SDQ20) U3.H3(DQL4)
DQ21: U1.P1(SDQ21) U3.H8(DQL5)
DQ22: U1.T1(SDQ22) U3.G2(DQL6)
DQ23: U1.M2(SDQ23) U3.H7(DQL7)
DQ24: U1.L1(SDQ24) U3.D7(DQU0)
DQ25: U1.H1(SDQ25) U3.C3(DQU1)
DQ26: U1.L2(SDQ26) U3.C8(DQU2)
DQ27: U1.H2(SDQ27) U3.C2(DQU3)
DQ28: U1.J1(SDQ28) U3.A7(DQU4)
DQ29: U1.M1(SDQ29) U3.A2(DQU5)
DQ30: U1.G2(SDQ30) U3.B8(DQU6)
DQ31: U1.K2(SDQ31) U3.A3(DQU7)
DVDD33: C77.2 C78.2 C79.2 C82.2 L2.2 R18.1 R31.1 U5.15(DVDD33) U5.21(DVDD33) U5.37(DVDD33)
EPHY-RST#: R38.1 U1.C13(ETXERR/CAN_RX/UART1_RING/PA17)
EXTEN: U13.20(EXTEN) U16.4(EN) U17.1(EN)
FMINL: GPIO-4.19 U1.Y20(FMINL)
FMINR: GPIO-4.17 U1.Y21(FMINR)
GMDC: U1.E10(EMDC/UART1_RX/PA11) U5.30(MDC)
GMDIO: R24.1 U1.D11(EMDIO/UART6_TX/UART1_RTS/PA12) U5.31(MDIO)
GND [PWR]: 5V_SATA_PWR224.2 C3.1 C4.1 C5.1 C6.1 C7.1 C8.1 C9.1 C10.1 C11.1 C12.1 C13.1 C14.1 C15.1 C16.1 C17.1 C18.1 C19.1 C20.1 C21.1 C22.1 C23.1 C24.1 C25.1 C26.1 C27.1 C28.1 C29.1 C30.1 C31.1 C32.1 C33.1 C34.1 C35.1 C36.1 C37.1 C38.1 C39.1 C40.1 C41.1 C42.1 C43.1 C44.1 C45.1 C46.1 C47.1 C48.1 C49.1 C50.1 C51.1 C52.1 C53.1 C54.1 C55.1 C56.1 C57.1 C58.1 C59.1 C60.1 C61.1 C62.1 C63.1 C64.1 C65.1 C66.1 C67.1 C68.1 C69.1 C70.1 C71.1 C72.1 C73.1 C74.1 C75.1 C76.1 C77.1 C78.1 C79.1 C80.1 C81.2 C82.1 C83.1 C84.1 C85.1 C86.1 C87.1 C88.1 C89.1 C90.1 C91.1 C92.1 C93.1 C94.1 C95.1 C96.1 C97.1 C98.1 C99.1 C100.1 C101.1 C102.1 C103.1 C104.1 C105.1 C106.1 C107.1 C108.1 C109.1 C110.1 C111.1 C112.1 C113.1 C114.1 C115.1 C116.1 C117.1 C118.1 C119.1 C120.1 C121.1 C122.1 C124.1 C130.1 C131.1 C132.1 C133.1 C134.1 C135.2 C136.2 C137.2 C138.1 C139.1 C140.1 C141.1 C142.1 C143.1 C144.1 C145.1 C146.2 C147.1 C148.1 C149.2 C150.2 C151.1 C152.2 C155.1 C158.1 C160.2 C161.2 C162.2 C163.1 C164.2 C165.1 C166.2 C167.2 C168.1 C169.1 C170.2 C171.1 C172.2 C173.2 C174.2 C175.2 C176.1 C177.1 C178.1 C179.2 C180.1 C181.1 C182.1 C183.2 C184.1 C185.2 C186.2 C187.1 C188.2 C189.2 C190.1 C191.2 C192.2 C193.2 C194.2 C195.1 C196.2 C197.1 C198.1 C199.1 C200.- C202.2 C203.2 C204.2 C205.2 C206.2 C207.1 C208.1 C210.2 C212.2 C213.2 C214.1 C215.- C216.- C217.- C218.- C219.- C220.1 C221.1 C222.1 C223.1 D3.A FET2.2(S) GND224.1(PP) GND_PIN224.P$1(PP) GPIO-1.2 GPIO-2.2 GPIO-3.2 GPIO-4.2 HDMI224.2 HDMI224.5 HDMI224.8 HDMI224.11 HDMI224.17 HDMI224.SH1 HDMI224.SH2 HDMI224.SH3 HDMI224.SH4 L7.1 L9.1 LCD_CON224.2 LCD_CON224.4 LED1.C LIPO_BAT224.2 PWR224.2_1 PWR_JACK224.- PWR_JACK224.-- PWR_LED224.C R4.1 R5.1 R7.1 R8.1 R12.2 R14.1 R15.2 R19.1 R26.1 R32.1 R33.2 R36.1 R44.2 R47.2 R48.2 R52.1 R53.1 R54.1 R58.1 R59.1 R62.1 R63.1 R65.1 R69.2 R72.1 R73.1 R74.1 R77.1 R80.2 R83.1(1.1) R84.1 R89.2 R90.2 R92.2 RECOVERY224.1_1 SATA224.1(GND) SATA224.4(GND) SATA224.7(GND) SD/MMC224.6(VSS) T1.2(E) U1.AA18(GND25_TVIN) U1.G3(GND_DRAM) U1.G4(GND_DRAM) U1.H16(TEST) U1.J5(GND_DRAM) U1.J11(GND) U1.K5(GND_DRAM) U1.K11(GND) U1.K12(GND) U1.K13(GND) U1.K14(ULGND) U1.L10(GND) U1.L11(GND) U1.L12(GND) U1.L13(UGND_T) U1.L14(UGND_C) U1.M9(GND_DLL) U1.M10(GND) U1.M11(GND) U1.M12(GND) U1.M13(GND) U1.M14(GND_SATA) U1.N5(GND_DRAM) U1.N10(GND_DLL) U1.N11(GND) U1.N12(GND) U1.N13(GND_SATA) U1.N14(GND_SATA) U1.P5(GND_DRAM) U1.P10(GND_DLL) U1.P11(GND) U1.P12(GND) U1.P13(GND_HDMI) U1.P14(GND_HDMI) U1.P15(PLLGND) U1.R11(GND) U1.R12(GND) U1.R13(GND_HDMI) U1.T9(EFUSE_VDDQ) U1.T11(GND) U1.T12(GND) U1.U5(GND_DRAM) U1.V5(GND_DRAM) U1.V19(HPGND) U1.W9(GND_LVDS) U1.W10(GND_LVDS) U1.W11(GND_LVDS) U1.W18(GND33_TVOUT) U1.Y7(GND_DRAM) U1.Y8(GND_DRAM) U1.Y18(GND33_TVIN) U2.A9(VSS) U2.B1(VSSQ) U2.B3(VSS) U2.B9(VSSQ) U2.D1(VSSQ) U2.D8(VSSQ) U2.E1(VSS) U2.E2(VSSQ) U2.E8(VSSQ) U2.F9(VSSQ) U2.G1(VSSQ) U2.G8(VSS) U2.G9(VSSQ) U2.J2(VSS) U2.J8(VSS) U2.M1(VSS) U2.M9(VSS) U2.P1(VSS) U2.P9(VSS) U2.T1(VSS) U2.T9(VSS) U3.A9(VSS) U3.B1(VSSQ) U3.B3(VSS) U3.B9(VSSQ) U3.D1(VSSQ) U3.D8(VSSQ) U3.E1(VSS) U3.E2(VSSQ) U3.E8(VSSQ) U3.F9(VSSQ) U3.G1(VSSQ) U3.G8(VSS) U3.G9(VSSQ) U3.J2(VSS) U3.J8(VSS) U3.M1(VSS) U3.M9(VSS) U3.P1(VSS) U3.P9(VSS) U3.T1(VSS) U3.T9(VSS) U4.13(VSS) U4.36(VSS) U5.7(GND) U5.20(GND) U5.33(GND) U5.47(GND) U6.1(A0) U6.2(A1) U6.3(A2) U6.4(GND) U6.7(WP) U7.3(GND) U7.8(GND) U8.3(GND) U8.8(GND) U9.3(GND) U9.8(GND) U10.2(GND) U11.2(GND) U12.2(GND) U13.9(PGND2) U13.16(PGND3) U13.22(AGND) U13.46(PGND1) U13.N1(GND_PAD) U13.N2(GND_PAD) U13.N3(GND_PAD) U13.N4(GND_PAD) U13.N5(GND_PAD) U13.N6(GND_PAD) U13.N7(GND_PAD) U13.N8(GND_PAD) U13.N9(GND_PAD) U13.N10(GND_PAD) U13.N11(GND_PAD) U13.N12(GND_PAD) U13.N13(GND_PAD) U13.N14(GND_PAD) U13.N15(GND_PAD) U13.N16(GND_PAD) U13.N17(GND_PAD) U13.VSS(GND_PAD) U14.3(GND) U15.2(GND) U16.2(GND) U17.2(GND) UART0.3 USB_HOST1.4 USB_HOST2.4 USB_OTG224.GND VR1.2(VSS)
GNDA: C123.1 C125.1 C126.1 C127.1 C128.1 C129.1 C209.2 GPIO-1.4 R43.2 R83.2(1.2) U1.U19(AGND)
GPIO1: R67.2 R69.1 U13.18(GPIO1)
GRXCK: R17.2 U1.D9(ERXCK/SPI3_MISO/PA8)
GRXD0: RM2.4.2 U1.E6(ERXD0/SPI1_MISO/PA3)
GRXD1: RM2.3.2 U1.D6(ERXD1/SPI1_MOSI/PA2)
GRXD2: RM2.2.2 U1.E5(ERXD2/SPI1_CLK/PA1)
GRXD3: RM2.1.2 U1.D5(ERXD3/SPI1_CS0/PA0)
GTXCK: U1.E12(ECRS/UART7_RX/UART1_DSR/PA15) U5.22(TXC)
GTXCTL: U1.E11(ETXEN/UART6_RX/UART1_CTS/PA13) U5.27(TXCTL/TXEN)
GTXD0: U1.E8(ETXD0/SPI3_MOSI/PA7) U5.23(TXD[0])
GTXD1: U1.D8(ETXD1/SPI3_CLK/PA6) U5.24(TXD[1])
GTXD2: U1.E7(ETXD2/SPI3_CS0/PA5) U5.25(TXD[2])
GTXD3: U1.D7(ETXD3/SPI1_CS1/PA4) U5.26(TXD[3])
HCEC: HDMI224.13 U1.P23(CEC_HDMI) U9.1(IN1) U9.10(OUT1)
HDMI_5V_SOURCE: FUSE1.2 HDMI224.18
HHPD: HDMI224.19 R47.1 U1.P22(HPD_HDMI) U9.5(IN4) U9.6(OUT4)
HPCOM: GPIO-1.16 U1.AA19(HPCOM) U1.AA20(HPCOMFB)
HPOUTL: GPIO-1.14 U1.Y19(HPOUTL)
HPOUTR: GPIO-1.18 U1.W19(HPOUTR)
HSCL: HDMI224.15 R45.1 U1.R23(SCL_HDMI) U9.2(IN2) U9.9(OUT2)
HSDA: HDMI224.16 R46.1 U1.R22(SDA_HDMI) U9.4(IN3) U9.7(OUT3)
HTX0N: HDMI224.9 U1.V22(TX0N_HDMI) U8.2(IN2) U8.9(OUT2)
HTX0P: HDMI224.7 U1.V23(TX0P_HDMI) U8.1(IN1) U8.10(OUT1)
HTX1N: HDMI224.6 U1.U22(TX1N_HDMI) U7.5(IN4) U7.6(OUT4)
HTX1P: HDMI224.4 U1.U23(TX1P_HDMI) U7.4(IN3) U7.7(OUT3)
HTX2N: HDMI224.3 U1.T22(TX2N_HDMI) U7.2(IN2) U7.9(OUT2)
HTX2P: HDMI224.1 U1.T23(TX2P_HDMI) U7.1(IN1) U7.10(OUT1)
HTXCN: HDMI224.12 U1.W22(TXCN_HDMI) U8.5(IN4) U8.6(OUT4)
HTXCP: HDMI224.10 U1.W23(TXCP_HDMI) U8.4(IN3) U8.7(OUT3)
IPSOUT: C155.2 C162.1 C170.1 C174.1 C182.2 C186.1 C202.1 C208.2 C210.1 IPSOUT224.1(PP) L15.1 R70.1 RESET224.1_1 U13.7(VIN2) U13.13(LDO24IN) U13.14(VIN3) U13.21(APS) U13.34(IPSOUT) U13.35(IPSOUT) U13.40(LDO3IN) U13.44(VIN1) U15.4(IN) U16.5(IN) U17.4(IN)
LAN_SH [lan_sh]: C214.2 LAN224.SH1 LAN224.SH2
LCD_CLK: LCD_CON224.31 U1.Y9(LCD0_CLK/SMC_VCCEN/PD24)
LCD_D0: LCD_CON224.21 U1.AB15(LCD0_D0/LVDS0_VP0/PD0)
LCD_D1: LCD_CON224.22 U1.AC15(LCD0_D1/LVDS0_VN0/PD1)
LCD_D2: LCD_CON224.23 U1.AB14(LCD0_D2/LVDS0_VP1/PD2)
LCD_D3: LCD_CON224.24 U1.AC14(LCD0_D3/LVDS0_VN1/PD3)
LCD_D4: LCD_CON224.25 U1.AB13(LCD0_D4/LVDS0_VP2/PD4)
LCD_D5: LCD_CON224.26 U1.AC13(LCD0_D5/LVDS0_VN2/PD5)
LCD_D6: LCD_CON224.27 U1.AB12(LCD0_D6/LVDS0_VPC/PD6)
LCD_D7: LCD_CON224.28 U1.AC12(LCD0_D7/LVDS0_VNC/PD7)
LCD_D8: LCD_CON224.13 U1.AB11(LCD0_D8/LVDS0_VP3/PD8)
LCD_D9: LCD_CON224.14 U1.AC11(LCD0_D9/LVDS0_VN3/PD9)
LCD_D10: LCD_CON224.15 U1.Y15(LCD0_D10/LVDS1_VP0/PD10)
LCD_D11: LCD_CON224.16 U1.AA15(LCD0_D11/LVDS1_VN0/PD11)
LCD_D12: LCD_CON224.17 U1.Y14(LCD0_D12/LVDS1_VP1/PD12)
LCD_D13: LCD_CON224.18 U1.AA14(LCD0_D13/LVDS1_VN1/PD13)
LCD_D14: LCD_CON224.19 U1.Y13(LCD0_D14/LVDS1_VP2/PD14)
LCD_D15: LCD_CON224.20 U1.AA13(LCD0_D15/LVDS1_VN2/PD15)
LCD_D16: LCD_CON224.5 U1.Y12(LCD0_D16/LVDS1_VPC/PD16)
LCD_D17: LCD_CON224.6 U1.AA12(LCD0_D17/LVDS1_VNC/PD17)
LCD_D18: LCD_CON224.7 U1.Y11(LCD0_D18/LVDS1_VP3/PD18)
LCD_D19: LCD_CON224.8 U1.AA11(LCD0_D19/LVDS1_VN3/PD19)
LCD_D20: LCD_CON224.9 U1.Y10(LCD0_D20/CSI1_MCLK/PD20)
LCD_D21: LCD_CON224.10 U1.AA10(LCD0_D21/SMC_VPPEN/PD21)
LCD_D22: LCD_CON224.11 U1.AB10(LCD0_D22/SMC_VPPPP/PD22)
LCD_D23: LCD_CON224.12 U1.AC10(LCD0_D23/SMC_DET/PD23)
LCD_DE: LCD_CON224.32 U1.AA9(LCD0_DE/SMC_RST/PD25)
LCD_HSYNC: LCD_CON224.29 U1.AB9(LCD0_HSYNC/SMC_SLK/PD26)
LCD_PWR: LCD_CON224.35 U1.C4(LCD1_D8/ATAD4/KP_IN0/MS_D0/EINT8/CSI1_D8/PH8)
LCD_VSYNC: LCD_CON224.30 U1.AC9(LCD0_VSYNC/SMC_SDA/PD27)
LDO3_2.8V [PWR]: C106.2 C185.1 GPIO-2.4 U1.F19(VCC_CSI0) U13.41(LDO3)
LDO4_2.8V [PWR]: C107.2 C188.1 U1.E18(VCC_CSI1) U13.11(LDO4)
LINEINL: GPIO-4.15 U1.AB20(LINEINL)
LINEINR: GPIO-4.13 U1.AB21(LINEINR)
LRADC0: C209.1 GPIO-1.6 R87.2 U1.AB23(LRADC0)
LRADC1: GPIO-1.8 U1.AB22(LRADC1)
MDI[0]+: LAN224.1 U5.1(MDI[0]+)
MDI[0]-: LAN224.2 U5.2(MDI[0]-)
MDI[1]+: LAN224.3 U5.4(MDI[1]+)
MDI[1]-: LAN224.4 U5.5(MDI[1]-)
MDI[2]+: LAN224.7 U5.8(MDI[2]+)
MDI[2]-: LAN224.8 U5.9(MDI[2]-)
MDI[3]+: LAN224.9 U5.11(MDI[3]+)
MDI[3]-: LAN224.10 U5.12(MDI[3]-)
MIC1OUTN: GPIO-4.8 U1.AC23(MIC1OUTN)
MIC1OUTP: GPIO-4.6 U1.AC22(MIC1OUTP)
MICIN1: GPIO-1.10 U1.AC20(MICIN1)
MICIN2: GPIO-4.10 U1.AC21(MICIN2)
N$1: C133.2 C134.2 U1.AC19(HPVCC)
N$2: R14.2 U1.AA7(SZQ)
N$3: R7.2 U2.L8(ZQ)
N$4: CHGLED224.A R70.2
N$5: PC3/PB8.2 R71.2
N$7: D2.C UART0.2
N$8: L14.1 U15.3(LX)
N$9: C171.2 U13.19(GPIO0/LDO)
N$10: D1.C R27.2
N$11: CHGLED224.C U13.36(CHGLED)
N$12: R80.1 U13.27(LDO1SET)
N$13: C151.2 C217.+ C218.+ C221.2 C222.2 C223.2 L10.1 U12.1(OUT)
N$14: C110.2 Q4.1 R35.1 U1.F1(CLK32K_IN)
N$15: R8.2 U3.L8(ZQ)
N$16: L4.1 U5.48(REG_OUT)
N$17: C175.1 R71.1 R73.2 T1.1(B)
N$18: FET1.1(G) R68.2 T1.3(C)
N$19: C201.2 R86.2 R90.1 U15.5(FB)
N$20: R26.2 U5.46(RSET)
N$21: FET2.3(D) FET3.1(G) R76.1
N$22: C104.2 Q1.2 U5.42(CKXTAL1)
N$23: C205.1 C206.1 D5.1(C) FET4.3(D) R85.2
N$24: 5V_E_SATA224.2 5V_SATA_PWR224.1 C168.2 C169.2 FET1.3(D)
N$25: C105.2 Q1.1 U5.43(CKXTAL2)
N$26: C111.2 R31.2 R34.2 R38.2 U5.29(PHYRSTB)
N$27: C102.2 LAN224.5
N$28: C103.2 LAN224.6
N$29: R33.1 R37.1 U5.38(RXDLY/LED_10/LED2)
N$30: LAN224.12 R36.2
N$31: LAN224.11 R32.2 U5.35(PHY_AD1/LED_1000/LED1)
N$33: FET2.1(G) FET4.1(G) R78.2 R84.2 U14.1(RESET)
N$34: R18.2 R19.2 U5.39(ENSWREG)
N$35: LAN224.13 R20.2
N$36: C81.1 R17.1 U5.19(RXC)
N$37: R15.1 R16.1 U5.13(RXCTL/RXDV)
N$38: PWR224.1_1 R75.1
N$42: C197.2 U1.AA16(VRP_TVIN)
N$43: RM2.4.1 U5.14(RXD[0])
N$44: R12.1 RM1.3.1 RM2.3.1 U5.16(RXD[1]/TXDLY)
N$46: RM1.2.1 RM2.2.1 U5.17(RXD[2]/AN0)
N$48: RM1.1.1 RM2.1.1 U5.18(RXD[3]/AN1)
N$50: LAN224.14 R21.1 U5.34(PHY_AD0/LED_DUPLEX/LED0)
N$52: R25.2 U5.32(CLK125)
N$58: R44.1 SD/MMC224.10(PACK1) SD/MMC224.11(PACK2) SD/MMC224.12(PACK3) SD/MMC224.13(PACK4)
N$64: L16.1 U17.3(LX)
N$66: C211.2 R91.2 R92.1 U17.5(FB)
N$99: R53.2 U10.3(ISET)
N$100: C138.2 C219.+ L6.2 R51.2 U10.1(OUT)
N$101: R63.2 U12.3(ISET)
N$106: C153.2 SATA224.2(A+)
N$111: C152.1 L10.2 USB_HOST2.1
N$112: C154.2 SATA224.3(A-)
N$113: C156.2 SATA224.5(B-)
N$114: C157.2 SATA224.6(B+)
N$116: C115.2 Q4.4 R35.2 U1.F2(CLK32K_OUT)
N$119: R72.2 U1.V21(REXT_SATA)
N$120: R74.2 U13.23(BIAS)
N$122: C128.2 C129.2 U1.W21(VRP)
N$123: D5.2(A) L15.2 U16.1(LX)
N$124: C112.2 R28.2 R29.2 U4.19(#WP)
N$125: R65.2 U13.37(TS)
N$126: R85.1 R89.1 U16.3(FB)
N$127: L11.1 U13.45(LX1)
N$128: C159.1 C160.1 L11.2 R66.1 U13.43(CHSENSE)
N$129: PWR_LED224.A R82.2
N$130: L12.1 U13.8(LX2)
N$131: L13.1 U13.15(LX3)
N$132: C180.2 U13.24(VREF)
N$133: C125.2 U1.W20(VRA1)
N$137: R59.2 U11.3(ISET)
N$139: C187.2 R75.2 U13.47(PWRON)
N$140: R77.2 RESET224.2_1 U13.4(N_OE)
N$176: C126.2 C127.2 R43.1 U1.V20(VRA2)
N$190: R48.1 U1.T10(JTAG_SEL)
N$193: L9.2 USB_HOST1.P$3 USB_HOST1.P$4 USB_HOST2.P$3 USB_HOST2.P$4
N$194: C149.1 L8.2 USB_HOST1.1
N$195: C147.2 C215.+ C216.+ C220.2 L8.1 U11.1(OUT)
N$223: C199.2 U1.Y16(VRN_TVIN)
N$229: LCD_CON224.33 R49.1
N$230: LCD_CON224.34 R50.1
N$231: LED1.A R88.2
N$232: NAND_E224.1 R23.2 U4.9(#CE)
N$266: L7.2 USB_OTG224.GND1 USB_OTG224.GND2 USB_OTG224.GND3 USB_OTG224.GND4
NALE: U1.M22(NALE/SPI0_MISO/PC1) U4.17(ALE)
NCE0: NAND_E224.2 U1.K23(NCE0/PC4)
NCLE: U1.L23(NCLE/SPI0_CLK/PC2) U4.16(CLE)
NDQ0: U1.H23(NDQ0/SDC2_D0/PC8) U4.29(I/O0)
NDQ1: U1.H22(NDQ1/SDC2_D1/PC9) U4.30(I/O1)
NDQ2: U1.G23(NDQ2/SDC2_D2/PC10) U4.31(I/O2)
NDQ3: U1.G22(NDQ3/SDC2_D3/PC11) U4.32(I/O3)
NDQ4: U1.H21(NDQ4/PC12) U4.41(I/O4)
NDQ5: U1.H20(NDQ5/PC13) U4.42(I/O5)
NDQ6: U1.G21(NDQ6/PC14) U4.43(I/O6)
NDQ7: U1.G20(NDQ7/PC15) U4.44(I/O7)
NMI_N: GPIO-4.4 R27.1 U1.F5(NMI#) U13.48(IRQ/WAKEUP)
NRB0: R22.2 U1.J23(NRB0/SDC2_CMD/PC6) U4.7(R/#B)
NRE: U1.K22(NRE#/PC5) U4.8(#RE)
NWE: U1.M23(NWE#/SPI0_MOSI/PC0) U4.18(#WE)
ODT0: R13.2 U1.AA5(ODT0)
PA9: GPIO-4.12 U1.E9(ERXERR/SPI3_CS1/PA9)
PA14: GPIO-4.14 U1.D12(ETXCK/UART7_TX/UART1_DTR/PA14)
PB2/PWM0: LCD_CON224.36 U1.A14(PWM0/PB2)
PB3: GPIO-3.4 R49.2 U1.B14(IR0_TX/SPDIF_MCLK/STANBYWFI/PB3)
PB4: GPIO-3.6 R50.2 U1.A13(IR0_RX/PB4)
PB5: GPIO-3.8 U1.B13(I2S_MCLK/AC97_MCLK/PB5)
PB6: GPIO-3.10 U1.A12(I2S_BCLK/AC97_BCLK/PB6)
PB7: GPIO-3.12 U1.B12(I2S_LRCK/AC97_SYNC/PB7)
PB8/SATA-PWR-EN: GPIO-3.14 PC3/PB8.1 U1.A11(I2S_DO0/AC97_DO/PB8)
PB9: GPIO-3.16 U1.C12(I2S_DO1/PB9)
PB10: GPIO-3.18 U1.C11(I2S_DO2/PB10)
PB11: GPIO-3.20 U1.C10(I2S_DO3/PB11)
PB12: GPIO-3.22 U1.C9(I2S_DI/AC97_DI/SPDIF_DI/PB12)
PB13: GPIO-3.24 U1.B11(SPI2_CS1/SPDIF_DO/PB13)
PB14: GPIO-3.26 RM4.1.1 U1.A10(JTAG_MS0/SPI2_CS0/PB14)
PB15: GPIO-3.28 RM4.2.1 U1.B10(JTAG_CK0/SPI2_CLK/PB15)
PB16: GPIO-3.30 U1.A9(JTAG_DO0/SPI2_MOSI/PB16)
PB17: GPIO-3.32 RM4.4.1 U1.B9(JTAG_DI0/SPI2_MISO/PB17)
PB18: GPIO-1.36 R39.2 R61.1 U1.A8(TWI1_SCK/PB18) U6.6(SCL)
PB19: GPIO-1.34 R40.1 R60.1 U1.B8(TWI1_SDA/PB19) U6.5(SDA)
PB20: GPIO-1.32 R57.1 U1.C8(TWI2_SCK/PB20)
PB21: GPIO-1.30 R56.1 U1.C7(TWI2_SDA/PB21)
PC3/SATA-PWR-EN: GPIO-1.29 PC3/PB8.3 U1.L22(NCE1/PC3)
PC7: GPIO-4.16 U1.J22(NRB1/SDC2_CLK/PC7)
PC16/NWP: GPIO-4.18 R28.1 U1.M21(NWP/PC16)
PC17/USB0-DRV: GPIO-4.20 R52.2 U1.F23(NCE2/PC17) U10.4(EN) U13.6(N_VBUSEN)
PC18: GPIO-1.31 U1.F22(NCE3/PC18)
PC19: GPIO-1.33 U1.L21(NCE4/SPI2_CS0/PC19)
PC20: GPIO-1.35 U1.K21(NCE5/SPI2_CLK/PC20)
PC21: GPIO-1.37 U1.J21(NCE6/SPI2_MOSI/PC21)
PC22: GPIO-1.39 U1.J20(NCE7/SPI2_MISO/PC22)
PC23: GPIO-1.40 U1.G19(SPI0_CS0/PC23)
PC24: GPIO-1.38 U1.F21(NDQS/PC24)
PE0: GPIO-2.6 U1.E23(TS0_CLK/CSI0_PCLK/PE0)
PE1 [PWR]: GPIO-2.8 U1.E22(TS0_ERR/CSI0_MCLK/PE1)
PE2: GPIO-2.10 U1.D23(TS0_SYNC/CSI0_HSYNC/PE2)
PE3 [PWR]: GPIO-2.12 U1.D22(TS0_DVLD/CSI0_VSYNC/PE3)
PE4: GPIO-2.14 U1.C23(TS0_D0/CSI0_D0/PE4)
PE5: GPIO-2.16 U1.C22(TS0_D1/CSI0_D1/PE5)
PE6: GPIO-2.18 U1.B23(TS0_D2/CSI0_D2/PE6)
PE7: GPIO-2.20 U1.B22(TS0_D3/CSI0_D3/PE7)
PE8: GPIO-2.22 U1.A23(TS0_D4/CSI0_D4/PE8)
PE9: GPIO-2.24 U1.A22(TS0_D5/CSI0_D5/PE9)
PE10: GPIO-2.26 U1.B21(TS0_D6/CSI0_D6/PE10)
PE11: GPIO-2.28 U1.A21(TS0_D7/CSI0_D7/PE11)
PG0: GPIO-1.5 U1.F20(TS1_CLK/CSI1_PCLK/SDC1_CMD/PG0)
PG1: GPIO-1.7 U1.E21(TS1_ERR/CSI1_MLCK/SDC1_CLK/PG1)
PG2: GPIO-1.9 U1.E20(TS1_SYNC/CSI1_HSYNC/SDC1_D0/PG2)
PG3: GPIO-1.11 U1.D21(TS1_DVLD/CSI1_VSYNC/SDC1_D1/PG3)
PG4: GPIO-1.13 U1.D20(TS1_D0/CSI1_D0/SDC1_D2/CSI0_D8/PG4)
PG5: GPIO-1.15 U1.C21(TS1_D1/CSI1_D1/SDC1_D3/CSI0_D9/PG5)
PG6: GPIO-1.17 U1.E19(TS1_D2/CSI1_D2/UART3_TX/CSI0_D10/PG6)
PG7: GPIO-1.19 U1.C20(TS1_D3/CSI1_D3/UART3_RX/CSI0_D11/PG7)
PG8: GPIO-1.21 U1.D19(TS1_D4/CSI1_D4/UART3_RTS/CSI0_D12/PG8)
PG9: GPIO-1.23 U1.C19(TS1_D5/CSI1_D5/UART3_CTS/CSI0_D13/PG9)
PG10: GPIO-1.25 U1.D18(TS1_D6/CSI1_D6/UART4_TX/CSI0_D14/PG10)
PG11: GPIO-1.27 U1.C18(TS1_D7/CSI1_D7/UART4_RX/CSI0_D15/PG11)
PH0: GPIO-3.7 U1.A6(LCD1_D0/ATAA0/UART3_TX/EINT0/CSI1_D0/PH0)
PH2/LED: R88.1 U1.C6(LCD1_D2/ATAA2/UART3_RTS/EINT2/CSI1_D2/PH2)
PH7: GPIO-3.9 U1.B4(LCD1_D7/ATAD3/UART5_RX/MS_CLK/EINT7/CSI1_D7/PH7)
PH9: GPIO-3.11 U1.D4(LCD1_D9/ATAD5/KP_IN1/MS_D1/EINT9/CSI1_D9/PH9)
PH10: GPIO-3.13 U1.A3(LCD1_D10/ATAD6/KP_IN2/MS_D2/EINT10/CSI1_D10/PH10)
PH11: GPIO-3.15 U1.B3(LCD1_D11/ATAD7/KP_IN3/MS_D3/EINT11/CSI1_D11/PH11)
PH12: GPIO-3.17 U1.C3(LCD1_D12/ATAD8/PS2_SCK1/EINT12/CSI1_D12/PH12)
PH13 [PWR]: GPIO-3.19 U1.A2(LCD1_D13/ATAD9/PS2_SDA1/SMC_RST/EINT13/CSI1_D13/PH13)
PH14: GPIO-3.21 U1.B2(LCD1_D14/ATAD10/KP_IN4/SMC_VPPEN/EINT14/CSI1_D14/PH14)
PH15 [PWR]: GPIO-3.23 U1.A1(LCD1_D15/ATAD11/KP_IN5/SMC_VPPPP/EINT15/CSI1_D15/PH15)
PH16: GPIO-3.25 U1.B1(LCD1_D16/ATAD12/KP_IN6/SMC_DET/EINT16/CSI1_D16/PH16)
PH17: GPIO-3.27 U1.C1(LCD1_D17/ATAD13/KP_IN7/SMC_VCCEN/EINT17/CSI1_D17/PH17)
PH18: GPIO-3.29 U1.C2(LCD1_D18/ATAD14/KP_OUT0/SMC_SLK/EINT18/CSI1_D18/PH18)
PH19: GPIO-3.31 U1.D1(LCD1_D19/ATAD15/KP_OUT1/SMC_SDA/EINT19/CSI1_D19/PH19)
PH20: GPIO-3.33 U1.D2(LCD1_D20/ATAOE/CAN_TX/EINT20/CSI1_D20/PH20)
PH21: GPIO-3.35 U1.D3(LCD1_D21/ATADREQ/CAN_RX/EINT21/CSI1_D21/PH21)
PH22: GPIO-3.37 U1.E1(LCD1_D22/ATADACK/KP_OUT2/SDC1_CMD/CSI1_D22/PH22)
PH23: GPIO-3.39 U1.E2(LCD1_D23/ATACS0/KP_OUT3/SDC1_CLK/CSI1_D23/PH23)
PH24: GPIO-3.34 U1.E3(LCD1_CLK/ATACS1/KP_OUT4/SDC1_D0/CSI1_PCLK/PH24)
PH25: GPIO-3.36 U1.E4(LCD1_DE/ATAIORDY/KP_OUT5/SDC1_D1/CSI1_FIELD/PH25)
PH26: GPIO-3.38 U1.F3(LCD1_HSYNC/ATAIOR/KP_OUT6/SDC1_D2/CSI1_HSYNC/PH26)
PH27: GPIO-3.40 U1.F4(LCD1_VSYNC/ATAIOW/KP_OUT7/SDC1_D3/CSI1_VSYNC/PH27)
PI0: GPIO-2.9 R93.1 U1.A20(GPS_CLK/PI0)
PI1: GPIO-2.11 R94.1 U1.B20(GPS_SIGN/PI1)
PI2: GPIO-2.13 R95.1 U1.A19(GPS_MAG/PI2)
PI3: GPIO-2.15 R96.1 U1.B19(PWM1/PI3)
PI4: GPIO-2.17 U1.A18(SDC3_CMD/PI4)
PI5: GPIO-2.19 U1.B18(SDC3_CLK/PI5)
PI6: GPIO-2.21 U1.A17(SDC3_D0/PI6)
PI7: GPIO-2.23 U1.B17(SDC3_D1/PI7)
PI8: GPIO-2.25 U1.A16(SDC3_D2/PI8)
PI9: GPIO-2.27 U1.B16(SDC3_D3/PI9)
PI10: GPIO-2.29 U1.C17(SPI0_CS0/UART5_TX/EINT22/PI10)
PI11: GPIO-2.31 U1.D17(SPI0_CLK/UART5_RX/EINT23/PI11)
PI12: GPIO-2.33 U1.C16(SPI0_MOSI/UART6_TX/EINT24/PI12)
PI13: GPIO-2.35 U1.D16(SPI0_MISO/UART6_RX/EINT25/PI13)
PI14: GPIO-2.37 U1.C15(PS2_SCK1/TCLKIN0/EINT26/SPI0_CS1/PI14)
PI15: GPIO-2.39 U1.D15(PS2_SDA1/TCLKIN1/EINT27/SPI1_CS1/PI15)
PI16: GPIO-2.40 U1.E17(EINT28/SPI1_CS0/UART2_RTS/PI16)
PI17: GPIO-2.38 U1.E16(EINT29/SPI1_CLK/UART2_CTS/PI17)
PI18: GPIO-2.36 U1.E15(EINT30/SPI1_MOSI/UART2_TX/PI18)
PI19: GPIO-2.34 U1.D14(EINT31/SPI1_MISO/UART2_RX/PI19)
PI20: GPIO-2.32 U1.E14(HSCL/UART7_TX/PS2_SCK0/PI20)
PI21: GPIO-2.30 U1.E13(HSDA/UART7_RX/PS2_SDA0/PI21)
RASN: U1.T4(SRAS) U2.J3(#RAS) U3.J3(#RAS)
RESET_N: C108.2 C109.2 GPIO-3.5 R30.1 R34.1 U1.C14(RESET#) U13.25(PWROK)
RXDV: R16.2 U1.D10(ERXDV/UART1_TX/PA10)
SA0: U1.W4(SA0) U2.N3(A0) U3.N3(A0)
SA1: U1.R4(SA1) U2.P7(A1) U3.P7(A1)
SA2: U1.U4(SA2) U2.P3(A2) U3.P3(A2)
SA3: U1.M4(SA3) U2.N2(A3) U3.N2(A3)
SA4: U1.Y4(SA4) U2.P8(A4) U3.P8(A4)
SA5: U1.N4(SA5) U2.P2(A5) U3.P2(A5)
SA6: U1.V4(SA6) U2.R8(A6) U3.R8(A6)
SA7: U1.M3(SA7) U2.R2(A7) U3.R2(A7)
SA8: U1.AA3(SA8) U2.T8(A8) U3.T8(A8)
SA9: U1.P4(SA9) U2.R3(A9) U3.R3(A9)
SA10: U1.L3(SA10) U2.L7(A10/AP) U3.L7(A10/AP)
SA11: U1.W3(SA11) U2.R7(A11) U3.R7(A11)
SA12: U1.P3(SA12) U2.N7(A12/#BC) U3.N7(A12/#BC)
SA13: U1.Y3(SA13) U2.T3(A13) U3.T3(A13)
SA14: U1.R3(SA14) U2.T7(NC/A14) U3.T7(NC/A14)
SA15: U1.AA4(SCS1) U2.M7(NC) U3.M7(NC)
SATA-RXM: C156.1 U1.U20(RXM_SATA)
SATA-RXP: C157.1 U1.U21(RXP_SATA)
SATA-TXM: C154.1 U1.T21(TXM_SATA)
SATA-TXP: C153.1 U1.T20(TXP_SATA)
SCK: R9.2 U1.V1(SCK)
SCK#: R10.2 U1.V2(SCK#)
SCS0: U1.V3(SCS0) U2.L2(#CS) U3.L2(#CS)
SD0-CLK: SD/MMC224.5(CLK/SCLK) U1.L20(SDC0_CLK/UART0_TX/PF2)
SD0-CMD: R42.1 SD/MMC224.3(CMD/DI) U1.L19(SDC0_CMD/JTAG_DO1/PF3)
SD0-D0: RM3.2.2 SD/MMC224.7(DAT0/DO) U1.M19(SDC0_D0/JTAG_DI1/PF1)
SD0-D1: RM3.3.2 SD/MMC224.8(DAT1/RES) U1.M20(SDC0_D1/JTAG_MS1/PF0)
SD0-D2: RM3.1.2 SD/MMC224.1(DAT2/RES) U1.K19(SDC0_D2/JTAG_CK1/PF5)
SD0-D3: R41.1 SD/MMC224.2(CD/DAT3/CS) U1.K20(SDC0_D3/UART0_RX/PF4)
SD0-DET#: RM3.4.2 SD/MMC224.9(CP_E) U1.B6(LCD1_D1/ATAA1/UART3_RX/EINT1/CSI1_D1/PH1)
SD_VCC: C122.2 C124.2 L5.2 SD/MMC224.4(VDD)
SDQM0: U1.AC6(SDQM0) U2.E7(DML)
SDQM1: U1.W1(SDQM1) U2.D3(DMU)
SDQM2: U1.R2(SDQM2) U3.E7(DML)
SDQM3: U1.G1(SDQM3) U3.D3(DMU)
SDQS0: U1.AB6(SDQS0) U2.F3(DQSL)
SDQS0_N: U1.AC5(SDQS0#) U2.G3(#DQSL)
SDQS1: U1.AB1(SDQS1) U2.C7(DQSU)
SDQS1_N: U1.AA2(SDQS1#) U2.B7(#DQSU)
SDQS2: U1.R1(SDQS2) U3.F3(DQSL)
SDQS2_N: U1.P2(SDQS2#) U3.G3(#DQSL)
SDQS3: U1.K1(SDQS3) U3.C7(DQSU)
SDQS3_N: U1.J2(SDQS3#) U3.B7(#DQSU)
SRST: R11.2 U1.AA6(SRST)
TPX1: C139.2 LCD_CON224.37 U1.Y22(XP_TP)
TPX2: C140.2 LCD_CON224.38 U1.AA22(XN_TP)
TPY1: C141.2 LCD_CON224.39 U1.Y23(YP_TP)
TPY2: C142.2 LCD_CON224.40 U1.AA23(YN_TP)
TVIN0: GPIO-4.5 U1.AC18(TVIN0)
TVIN1: GPIO-4.7 U1.AB18(TVIN1)
TVIN2: GPIO-4.9 U1.AA17(TVIN2)
TVIN3: GPIO-4.11 U1.Y17(TVIN3)
TVOUT3: GPIO-4.3 U1.AB17(TVOUT3)
TWI0-SCK: GPIO-2.5 R79.1 U1.A15(TWI0_SCK/PB0) U13.2(SCK)
TWI0-SDA: GPIO-2.7 R81.1 U1.B15(TWI0_SDA/PB1) U13.1(SDA)
UART0-RX: D2.A GPIO-1.26 R64.1 U1.B7(UART0_RX/IR1_RX/PB23)
UART0-TX: GPIO-1.28 U1.A7(UART0_TX/IR1_TX/PB22) UART0.1
UBOOT_SEL: RECOVERY224.2_1 U1.W8(UBOOT_SEL)
UDM0: U1.N20(DM0) USB_OTG224.D-
UDM1: U1.P20(DM1) USB_HOST1.2
UDM2: U1.R20(DM2) USB_HOST2.2
UDP0: U1.N21(DP0) USB_OTG224.D+
UDP1: U1.P21(DP1) USB_HOST1.3
UDP2: U1.R21(DP2) USB_HOST2.3
USB0-IDDET: R55.2 U1.B5(LCD1_D4/ATAD0/UART4_TX/EINT4/CSI1_D4/PH4) USB_OTG224.ID
USB0-VBUSDET: C135.1 R51.1 R54.2 U1.C5(LCD1_D5/ATAD1/UART4_RX/EINT5/CSI1_D5/PH5)
USB1-DRV [PWR]: R58.2 U1.A4(LCD1_D6/ATAD2/UART5_TX/MS_BS/EINT6/CSI1_D6/PH6) U11.4(EN)
USB2-DRV [PWR]: R62.2 U1.A5(LCD1_D3/ATAIRQ/UART3_CTS/EINT3/CSI1_D3/PH3) U12.4(EN)
V+: 1.5V224.1(PP) C1.1 C2.1 C3.2 C4.2 C5.2 C6.2 C7.2 C8.2 C9.2 C10.2 C11.2 C12.2 C19.2 C20.2 C21.2 C22.2 C23.2 C24.2 C25.2 C26.2 C27.2 C28.2 C29.2 C30.2 C31.2 C32.2 C33.2 C34.2 C35.2 C36.2 C47.2 C48.2 C49.2 C50.2 C51.2 C52.2 C53.2 C54.2 C55.2 C56.2 C57.2 C58.2 C59.2 C60.2 C61.2 C62.2 C63.2 C64.2 C201.1 C203.1 C204.1 L14.2 R1.2 R2.2 R6.2 R86.1 U1.G5(VCC_DRAM) U1.H5(VCC_DRAM) U1.L5(VCC_DRAM) U1.M5(VCC_DRAM) U1.R5(VCC_DRAM) U1.T5(VCC_DRAM) U1.W5(VCC_DRAM) U1.W6(VCC_DRAM) U1.W7(VCC_DRAM) U1.Y6(VCC_DRAM) U2.A1(VDDQ) U2.A8(VDDQ) U2.B2(VDD) U2.C1(VDDQ) U2.C9(VDDQ) U2.D2(VDDQ) U2.D9(VDD) U2.E9(VDDQ) U2.F1(VDDQ) U2.G7(VDD) U2.H2(VDDQ) U2.H9(VDDQ) U2.K2(VDD) U2.K8(VDD) U2.N1(VDD) U2.N9(VDD) U2.R1(VDD) U2.R9(VDD) U3.A1(VDDQ) U3.A8(VDDQ) U3.B2(VDD) U3.C1(VDDQ) U3.C9(VDDQ) U3.D2(VDDQ) U3.D9(VDD) U3.E9(VDDQ) U3.F1(VDDQ) U3.G7(VDD) U3.H2(VDDQ) U3.H9(VDDQ) U3.K2(VDD) U3.K8(VDD) U3.N1(VDD) U3.N9(VDD) U3.R1(VDD) U3.R9(VDD) ; supply symbol labelled 1.5V
VCC [PWR]: 3.3V224.1(PP) C74.2 C75.2 C76.2 C92.2 C93.2 C94.2 C95.2 C96.2 C97.2 C98.2 C99.2 C100.2 C113.2 C114.2 C120.2 C121.2 C130.2 C131.2 C132.2 C143.2 C144.2 C164.1 C165.2 C191.1 C194.1 C195.2 C196.1 C198.2 C211.1 C212.1 C213.1 D1.A GPIO-1.3 GPIO-2.3 GPIO-3.3 GPIO-4.1 L1.1 L2.1 L3.1 L5.1 L16.2 LCD_CON224.3 R20.1 R21.2 R22.1 R23.1 R24.2 R29.1 R30.2 R37.2 R39.1 R40.2 R41.2 R42.2 R55.1 R56.2 R57.2 R60.2 R61.2 R64.2 R79.2 R81.2 R91.1 R93.2 R94.2 R95.2 R96.2 RM1.1.2 RM1.2.2 RM1.3.2 RM3.1.1 RM3.2.1 RM3.3.1 RM3.4.1 RM4.1.2 RM4.2.2 RM4.4.2 U1.AB19(HPVCCIN) U1.H8(VCC) U1.H9(VCC) U1.H10(VCC) U1.H15(VCC) U1.H19(VCC_NAND) U1.J8(VCC) U1.J9(VCC) U1.J10(VCC) U1.J14(VCC) U1.J19(VCC_NAND) U1.L15(UVCC_T) U1.L16(UVCC_C) U1.N19(VCC_CARD) U1.P16(PLLVP25) U1.T13(VP_HDMI) U1.W12(VCC_LVDS) U1.W13(VCC_LVDS) U1.W14(VCC_LVDS) U1.W15(VCC33_TVOUT) U1.W16(VCC33_TVIN) U4.12(VCC) U4.37(VCC) U6.8(VCC) VR1.1(VIN) VR1.3(CE) ; supply symbol labelled 3.3V
VCC/2: 1.2V_CPU224.1(PP) C65.2 C66.2 C67.2 C68.2 C69.2 C70.2 C166.1 C167.1 L12.2 U1.H11(VDD_CPU) U1.H12(VDD_CPU) U1.H13(VDD_CPU) U1.H14(VDD_CPU) U1.J12(VDD_CPU) U1.J13(VDD_CPU) U13.10(DCDC2) ; supply symbol labelled 1.2V_CPU
VCCINT: 1.2V_INT224.1(PP) C15.2 C16.2 C17.2 C18.2 C37.2 C38.2 C39.2 C40.2 C41.2 C42.2 C43.2 C44.2 C45.2 C46.2 C145.2 C148.2 C172.1 C173.1 C181.2 C184.2 L13.2 U1.J15(VDD_INT) U1.J16(VDD_INT) U1.K9(VDD_INT) U1.K10(VDD_INT) U1.K15(VDD_INT) U1.K16(ULVDD) U1.L8(VDD_INT) U1.L9(VDD_INT) U1.M8(VDD_DLL) U1.M15(VDD12_SATA) U1.M16(VDD12_SATA) U1.N9(VDD_DLL) U1.P9(VDD_DLL) U1.R9(VDD_INT) U1.R10(VDD_INT) U1.T8(VDD_INT) U13.17(DCDC3) ; supply symbol labelled 1.2V_INT
VDD: 2.5V224.1(PP) C177.2 C178.2 C189.1 C190.2 C192.1 C193.1 U1.N15(VDD25_SATA) U1.N16(VDD25_SATA) U1.W17(VDD25_TVIN) VR1.5(VOUT) ; supply symbol labelled 2.5V
VDD_RTC: C118.2 C119.2 C179.1 U1.K8(RTC_VDD) U13.28(LDO1)
VDDREG1: C83.2 C84.2 C85.2 L3.2 U5.44(VDDREG) U5.45(VDDREG)
VGA-B: GPIO-1.22 U1.AB16(TVOUT1/VGA-B)
VGA-G: GPIO-1.20 U1.AC16(TVOUT0/VGA-G)
VGA-R: GPIO-1.24 U1.AC17(TVOUT2/VGA-R)
VINT: C176.2 U13.26(VINT)
VMIC: GPIO-1.12 U1.AA21(VMIC)
VPP [PWR]: 3.0VA224.1(PP) C123.2 C183.1 R87.1 U1.T19(AVCC) U13.12(LDO2) U15.1(EN) ; supply symbol labelled 3.0VA
WEN: U1.T3(SWE) U2.L3(#WE) U3.L3(#WE)
XTALI: C116.2 Q3.2 U1.N23(CLK24M_IN)
XTALO: C117.2 Q3.1 U1.N22(CLK24M_OUT)
Unconnected: HDMI224.14 RM1.4.1 RM1.4.2 RM4.3.1 RM4.3.2 U1.J3(ODT1) U1.J4(SCKE1) U1.N8(ADBG) U1.P8(SDBG0) U1.P19(CLKM_SATA) U1.R8(SDBG1) U1.R14(VREGIO2_HDMI) U1.R15(PLLVREG) U1.R16(PLLREGIO) U1.R19(CLKP_SATA) U1.T14(VREGIO1_HDMI) U1.T15(PLLTEST) U1.T16(PLLDV) U2.J1(NC) U2.J9(NC) U2.L1(NC) U2.L9(NC) U3.J1(NC) U3.J9(NC) U3.L1(NC) U3.L9(NC) U4.1(NC) U4.2(NC) U4.3(NC) U4.4(NC) U4.5(NC) U4.6(NC) U4.10(NC) U4.11(NC) U4.14(NC) U4.15(NC) U4.20(NC) U4.21(NC) U4.22(NC) U4.23(NC) U4.24(NC) U4.25(NC) U4.26(NC) U4.27(NC) U4.28(NC) U4.33(NC) U4.34(NC) U4.35(NC) U4.38(NC) U4.39(NC) U4.40(NC) U4.45(NC) U4.46(NC) U4.47(NC) U4.48(NC) U13.3(GPIO3) U13.5(GPIO2) U13.29(DC3SET) U13.30(BACKUP) U16.6(NC)

## Buses
SA[0..14]
DQ[0..31]
BA[0..2],CLK,CLKN,CKE,CASN,RASN,WEN,SDQM[0..3],SDQS[0..3],SDQS0_N,SDQS1_N,SDQS2_N,SDQS3_N,DDR3_RST,DDR3_ODT,SCS0,SA15
LCD_D[0..7],LCD_D[8..15],LCD_D[16..23],LCD_HSYNC,LCD_VSYNC,LCD_CLK,LCD_DE
NDQ[0..7],NWE,NALE,NCLE,NCE0,NCE1,NRE,NRB[0..1],NDQS
GTXD[0..3],GTXCTL,GTXCK,GRXD[0..3],ERXDV,GRXCK,GMDC,GMDIO,CLK125
SATA-TXP,SATA-TXM,SATA-RXM,SATA-RXP
HTX0P,HTX0N,HTX1P,HTX1N,HTX2P,HTX2N,HTXCP,HTXCN,HSCL,HSDA,HHPD,HCEC
MDI[0..3]

## Notes on the sheet
- 1 x [4Gb DDR3 SDRAM (256Mx16)]
- We have used a number of fully compatible
- but different DDR3 memories due to supply unavailability.
- In such cases the memory part name
- in the schematic might remain outdated.
- It is recommended to always refer to the
- exact memory name printed on the component itself.
- GIGABIT ETHERNET TRANSCEIVER
- NAND Flash
- 32Gb (4096M x 8bit)
- Wider than 40mils
- Wider than 60mils
- Wider than 60mils
- EEPROM
- MicroSD
- 16 Kbit
- (2048 x 8)
- MAC Address
- HDMI
- LCD EXTENSION | GPIO EXTENSION
- 5.0V | GND
- 3.3V | GND
- R0 | R1
- R2 | R3
- R4 | R5
- R6 | R7
- G0 | G1
- G2 | G3
- G4 | G5
- G6 | G7
- B0 | B1
- B2 | B3
- B4 | B5
- B6 | B7
- HSYNC | VSYNC
- CLK | DE
- L/R | U/D
- PWRE | BKL | USB-OTG
- X1 | X2
- Y1 | Y2
- Iset = 6800/Rs
- Rs
- Iset = 523mA
- USB-HOSTs
- Rs
- Iset = 6800/Rs
- Iset = 1000mA
- Rs
- Iset = 6800/Rs
- Iset = 523mA
- POWER SUPPLY CIRCUIT
- SATA
- 1V2/1.6A
- +
- -
- 1V2/1.2A
- 1V3/30mA
- 3V/200mA
- 2V8/200mA
- 2V8/200mA
- Must be Floating!!!
- 5VDC Only!!!
- LED | BUTTON | ADC
- +
- Rc
- -
- LI-ION_BATTERY
- Rd
- Vout=0.6x(1+Rc/Rd)
- Re
- Rf
- Vout=0.6x(1+Re/Rf)

## Library data of the parts
1.2V_CPU224 1.2V_INT224 1.5V224 2.5V224 3.0VA224 3.3V224 5VEXT224 +5V224 BAT224 GND224 GND_PIN224 IPSOUT224 = gogo:TESTPAD: drill 40mils, diameter 70mils
5V_E224 5V_E_SATA224 NAND_E224 = jumper:SJ: SMD solder JUMPER
5V_SATA_PWR224 LIPO_BAT224 = Penko:CON2
C1-C199 C201-C214 C220-C223 = rcl:C-EU: CAPACITOR, European symbol
C200 C215-C219 = rcl:CPOL-EU: POLARIZED CAPACITOR, European symbol
CHGLED224 LED1 PWR_LED224 = DOUBLE-SIDE:LED
D1 D2 D4 = gogo:SCHOTKKY7.62SS
D3 = OLIMEX_DISCRET:SMBJ16A
D5 = semicon-smd-ipc:D-: DIODE unfilled
FET1 FET3 FET4 = Penko:P-MOS+DIOD
FET2 = Penko:N-MOS+DIOD
FUSE1 = gogo:FUSE
GPIO-1-GPIO-3 LCD_CON224 = con-harting-ml:ML40: HARTING
GPIO-4 = con-harting-ml:ML20: HARTING
HDMI224 = OLIMEX_CONNECTORS:HDMI-MC34931
L1-L3 L5-L10 = rcl:L-US: INDUCTOR, American symbol
L4 L11-L16 = OLIMEX_DISCRET:L
LAN224 = OLIMEX_CONNECTORS:TM211Q01FM22_SH
PC3/PB8 = jumper:SJ2W: SMD solder JUMPER
PWR224 RECOVERY224 RESET224 = gogo:SW-TAKT
PWR_JACK224 = gogo:PWR-JAK
Q1 Q3 = crystal:HC49/S: CRYSTAL
Q4 = crystal:MC-306
R1-R82 R84-R96 = rcl:R-EU_: RESISTOR, European symbol
R83 = OLIMEX_DISCRET:R_0R
RM1-RM4 = OLIMEX_DISCRET:R_MATRIX_4E
SATA224 = OLIMEX_CONNECTORS:SATA-PWA-07
SD/MMC224 = OLIMEX_CONNECTORS:MICRO_SD/MMC_CP_NEW
T1 = semicon-smd-ipc:NPN-TRANSISTOR_: NPN TRANSISTOR
U1 = OLIMEX_IC:A10
U2 U3 = OLIMEX_IC:H5TQ2G63BFR_MEM4G16D3EABG-125
U4 = OLIMEX_IC:H27UBG8T2A
U5 = OLIMEX_IC:RTL8211CL-GR: RTL8211CL-GR INTEGRATED 10/100/1000 GIGABIT ETHERNET TRANSCEIVER This element was created by Penko Bozhkov
U6 = gogo:24LCXX
U7-U9 = OLIMEX_IC:RCLAMP0524P
U10-U12 = OLIMEX_IC:SY6280
U13 = OLIMEX_IC:AXP209
U14 = gogo:RESET: Microcontroller Supervisory Circuit with Open Drain Output
U15 U17 = OLIMEX_IC:SY8008
U16 = OLIMEX_IC:SY7208
U18-U21 = SparkFunEagle-6-6-07:FIDUCIAL: Fiducial Alignment Points Various fiducial points for machine vision alignment.
UART0 = Penko:CON3
USB_HOST1 USB_HOST2 = OLIMEX_CONNECTORS:USB_SHIELD
USB_OTG224 = OLIMEX_CONNECTORS:MINI_USB9
VR1 = OLIMEX_DISCRET:AP1231

## Net classes
2 lan_sh: clearance 0.762 mm